# EAGLE design Adafruit PyPortal (EAGLE 9.3.0)

## Sheet 1 of 3
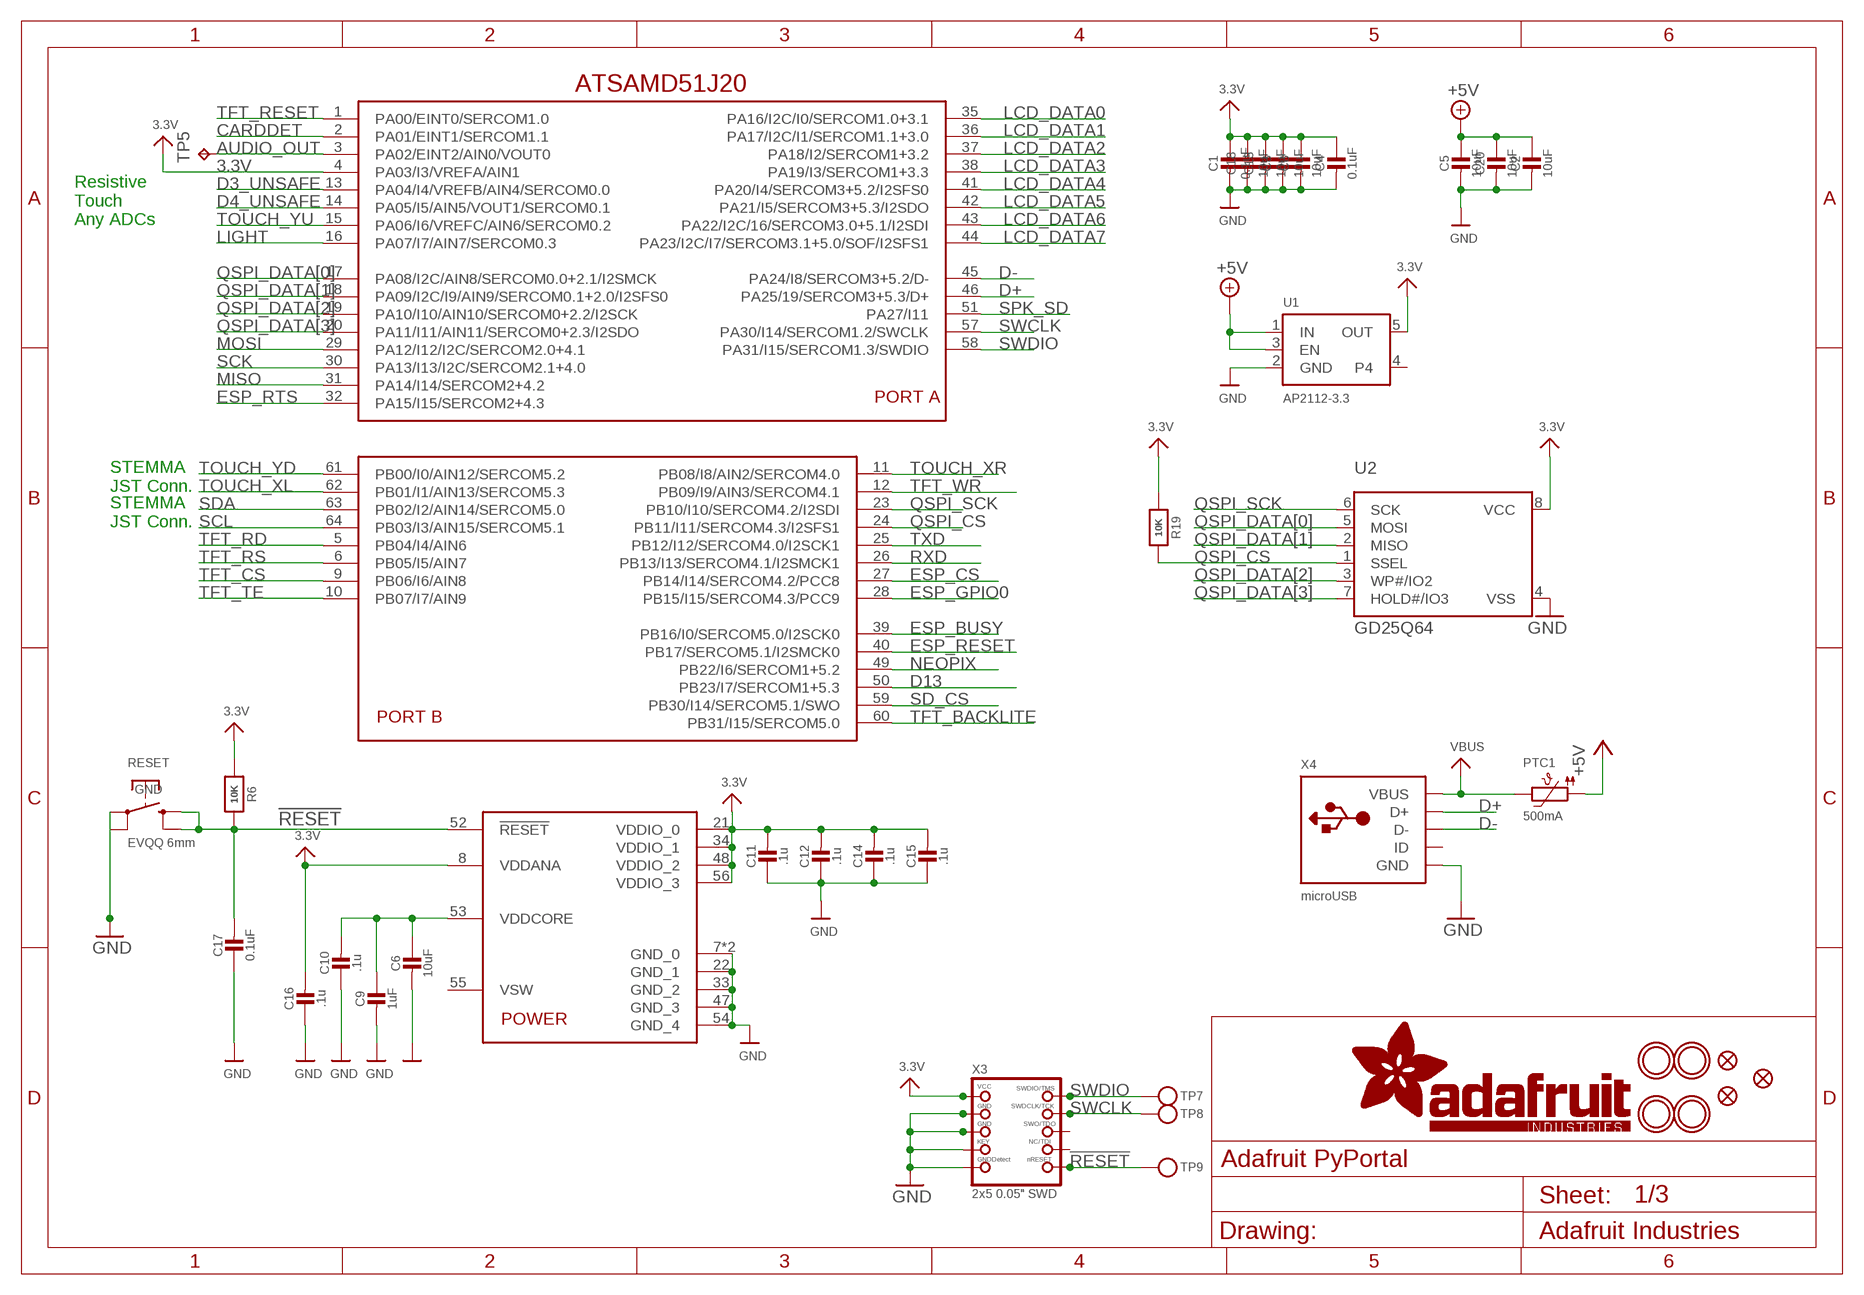
[diagram p0: schematic, sheet 1]

### Parts
C1  0.1uF  CAP_CERAMIC0603_NO  [0603-NO]
C2  10uF  CAP_CERAMIC0805-NOOUTLINE  [0805-NO]
C3  10uF  CAP_CERAMIC0805-NOOUTLINE  [0805-NO]
C4  0.1uF  CAP_CERAMIC0805-NOOUTLINE  [0805-NO]
C5  10uF  CAP_CERAMIC0805-NOOUTLINE  [0805-NO]
C6  10uF  CAP_CERAMIC0805-NOOUTLINE  [0805-NO]
C8  10uF  CAP_CERAMIC0805-NOOUTLINE  [0805-NO]
C9  1uF  CAP_CERAMIC0603_NO  [0603-NO]
C10  .1u  CAP_CERAMIC0603_NO  [0603-NO]
C11  .1u  CAP_CERAMIC0603_NO  [0603-NO]
C12  .1u  CAP_CERAMIC0603_NO  [0603-NO]
C13  10uF  CAP_CERAMIC0805-NOOUTLINE  [0805-NO]
C14  .1u  CAP_CERAMIC0603_NO  [0603-NO]
C15  .1u  CAP_CERAMIC0603_NO  [0603-NO]
C16  .1u  CAP_CERAMIC0603_NO  [0603-NO]
C17  0.1uF  CAP_CERAMIC0603_NO  [0603-NO]
C18  10uF  CAP_CERAMIC0805-NOOUTLINE  [0805-NO]
C20  10uF  CAP_CERAMIC0805-NOOUTLINE  [0805-NO]
PTC1  500mA  PTC1206  [1206]
R6  10K  RESISTOR_0603_NOOUT  [0603-NO]
R19  10K  RESISTOR_0603_NOOUT  [0603-NO]
RESET  EVQQ 6mm  SWITCH_TACT_SMT_EVQQ2_SMALL  [EVQ-Q2_SMALLER]
TP5  TPTP15R  [TP15R]
TP7  TESTPOINTROUND1.5MM  [TESTPOINT_ROUND_1.5MM]
TP8  TESTPOINTROUND1.5MM  [TESTPOINT_ROUND_1.5MM]
TP9  TESTPOINTROUND1.5MM  [TESTPOINT_ROUND_1.5MM]
U1  AP2112-3.3  VREG_SOT23-5  [SOT23-5]
U2  GD25Q64  SPIFLASH_8PIN208MIL  [SOIC8_208MIL]
U$2  ATSAMD51J20  ATSAMD51J  [PQFN64-1]
U$7  MOUNTINGHOLE3.0THIN  [MOUNTINGHOLE_3.0_PLATEDTHIN]
U$9  FIDUCIAL_1MM  [FIDUCIAL_1MM]
U$11  FIDUCIAL_1MM  [FIDUCIAL_1MM]
U$15  MOUNTINGHOLE3.0THIN  [MOUNTINGHOLE_3.0_PLATEDTHIN]
U$16  MOUNTINGHOLE3.0THIN  [MOUNTINGHOLE_3.0_PLATEDTHIN]
U$17  MOUNTINGHOLE3.0THIN  [MOUNTINGHOLE_3.0_PLATEDTHIN]
U$23  FIDUCIAL_1MM  [FIDUCIAL_1MM]
X3  2x5 0.05" SWD  JTAG-CORTEXBOXPOSTS  [2X05_1.27MM_BOX_POSTS]
X4  microUSB  USB_MICRO_20329_V2  [4UCONN_20329_V2]

### Nets
3.3V [power]: C1.1 C3.1 C4.1 C8.1 C11.2 C12.2 C13.1 C14.2 C15.2 C16.2 C18.1 R6.1 R19.1 U1.5(OUT) U2.8(VCC) U$2.4(PA03/I3/VREFA/AIN1) U$2.8(VDDANA) U$2.21(VDDIO_0) U$2.34(VDDIO_1) U$2.48(VDDIO_2) U$2.56(VDDIO_3) X3.1(VCC) ; also sheet 2,3
!RESET: C17.2 R6.2 RESET.B'(S1) RESET.B(S) TP9.P$1 U$2.52(!RESET) X3.10(NRESET)
+5V [power]: C2.1 C5.1 C20.1 PTC1.1 U1.1(IN) U1.3(EN) ; also sheet 2,3
AUDIO_OUT: TP5.TP U$2.3(PA02/EINT2/AIN0/VOUT0) ; also sheet 3
CARDDET: U$2.2(PA01/EINT1/SERCOM1.1) ; also sheet 2
D3_UNSAFE: U$2.13(PA04/I4/VREFB/AIN4/SERCOM0.0) ; also sheet 3
D4_UNSAFE: U$2.14(PA05/I5/AIN5/VOUT1/SERCOM0.1) ; also sheet 3
D13: U$2.50(PB23/I7/SERCOM1+5.3) ; also sheet 3
D+: U$2.46(PA25/19/SERCOM3+5.3/D+) X4.D+
D-: U$2.45(PA24/I8/SERCOM3+5.2/D-) X4.D-
ESP_BUSY: U$2.39(PB16/I0/SERCOM5.0/I2SCK0) ; also sheet 2
ESP_CS: U$2.27(PB14/I14/SERCOM4.2/PCC8) ; also sheet 2
ESP_GPIO0: U$2.28(PB15/I15/SERCOM4.3/PCC9) ; also sheet 2
ESP_RESET: U$2.40(PB17/SERCOM5.1/I2SMCK0) ; also sheet 2
ESP_RTS: U$2.32(PA15/I15/SERCOM2+4.3) ; also sheet 2
GND: C1.2 C2.2 C3.2 C4.2 C5.2 C6.2 C8.2 C9.2 C10.1 C11.1 C12.1 C13.2 C14.1 C15.1 C16.1 C17.1 C18.2 C20.2 RESET.A'(P1) RESET.A(P) U1.2(GND) U2.4(VSS) U$2.7(GND_0) U$2.22(GND_1) U$2.33(GND_2) U$2.47(GND_3) U$2.54(GND_4) U$2.EXP(GND_0) X3.3(GND) X3.5(GND) X3.7(KEY) X3.9(GNDDETECT) X4.BASE@1(GND) X4.BASE@2(GND) X4.GND X4.SPRT@1(GND) X4.SPRT@2(GND) X4.SPRT@3(GND) X4.SPRT@4(GND) ; also sheet 2,3
LCD_DATA0: U$2.35(PA16/I2C/I0/SERCOM1.0+3.1) ; also sheet 2
LCD_DATA1: U$2.36(PA17/I2C/I1/SERCOM1.1+3.0) ; also sheet 2
LCD_DATA2: U$2.37(PA18/I2/SERCOM1+3.2) ; also sheet 2
LCD_DATA3: U$2.38(PA19/I3/SERCOM1+3.3) ; also sheet 2
LCD_DATA4: U$2.41(PA20/I4/SERCOM3+5.2/I2SFS0) ; also sheet 2
LCD_DATA5: U$2.42(PA21/I5/SERCOM3+5.3/I2SDO) ; also sheet 2
LCD_DATA6: U$2.43(PA22/I2C/16/SERCOM3.0+5.1/I2SDI) ; also sheet 2
LCD_DATA7: U$2.44(PA23/I2C/I7/SERCOM3.1+5.0/SOF/I2SFS1) ; also sheet 2
LIGHT: U$2.16(PA07/I7/AIN7/SERCOM0.3) ; also sheet 3
MISO: U$2.31(PA14/I14/SERCOM2+4.2) ; also sheet 2
MOSI: U$2.29(PA12/I12/I2C/SERCOM2.0+4.1) ; also sheet 2
NEOPIX: U$2.49(PB22/I6/SERCOM1+5.2) ; also sheet 3
QSPI_CS: R19.2 U2.1(SSEL) U$2.24(PB11/I11/SERCOM4.3/I2SFS1)
QSPI_DATA[0]: U2.5(MOSI) U$2.17(PA08/I2C/AIN8/SERCOM0.0+2.1/I2SMCK)
QSPI_DATA[1]: U2.2(MISO) U$2.18(PA09/I2C/I9/AIN9/SERCOM0.1+2.0/I2SFS0)
QSPI_DATA[2]: U2.3(WP#/IO2) U$2.19(PA10/I10/AIN10/SERCOM0+2.2/I2SCK)
QSPI_DATA[3]: U2.7(HOLD#/IO3) U$2.20(PA11/I11/AIN11/SERCOM0+2.3/I2SDO)
QSPI_SCK: U2.6(SCK) U$2.23(PB10/I10/SERCOM4.2/I2SDI)
RXD: U$2.26(PB13/I13/SERCOM4.1/I2SMCK1) ; also sheet 2
SCK: U$2.30(PA13/I13/I2C/SERCOM2.1+4.0) ; also sheet 2
SCL: U$2.64(PB03/I3/AIN15/SERCOM5.1) ; also sheet 3
SD_CS: U$2.59(PB30/I14/SERCOM5.1/SWO) ; also sheet 2
SDA: U$2.63(PB02/I2/AIN14/SERCOM5.0) ; also sheet 3
SPK_SD: U$2.51(PA27/I11) ; also sheet 3
SWCLK: TP8.P$1 U$2.57(PA30/I14/SERCOM1.2/SWCLK) X3.4(SWDCLK)
SWDIO: TP7.P$1 U$2.58(PA31/I15/SERCOM1.3/SWDIO) X3.2(SWDIO)
TFT_BACKLITE: U$2.60(PB31/I15/SERCOM5.0) ; also sheet 2
TFT_CS: U$2.9(PB06/I6/AIN8) ; also sheet 2
TFT_RD: U$2.5(PB04/I4/AIN6) ; also sheet 2
TFT_RESET: U$2.1(PA00/EINT0/SERCOM1.0) ; also sheet 2
TFT_RS: U$2.6(PB05/I5/AIN7) ; also sheet 2
TFT_TE: U$2.10(PB07/I7/AIN9) ; also sheet 2
TFT_WR: U$2.12(PB09/I9/AIN3/SERCOM4.1) ; also sheet 2
TOUCH_XL: U$2.62(PB01/I1/AIN13/SERCOM5.3) ; also sheet 2
TOUCH_XR: U$2.11(PB08/I8/AIN2/SERCOM4.0) ; also sheet 2
TOUCH_YD: U$2.61(PB00/I0/AIN12/SERCOM5.2) ; also sheet 2
TOUCH_YU: U$2.15(PA06/I6/VREFC/AIN6/SERCOM0.2) ; also sheet 2
TXD: U$2.25(PB12/I12/SERCOM4.0/I2SCK1) ; also sheet 2
VBUS [power]: PTC1.2 X4.VBUS
VDDCORE: C6.1 C9.1 C10.2 U$2.53(VDDCORE)
Unconnected: U1.4 U$2.55(VSW) X3.6(SWO) X3.8(TDI) X4.ID

### Notes on the sheet
- ATSAMD51J20
- Resistive
  Touch
  Any ADCs
- STEMMA
  JST Conn.
- STEMMA
  JST Conn.

## Sheet 2 of 3
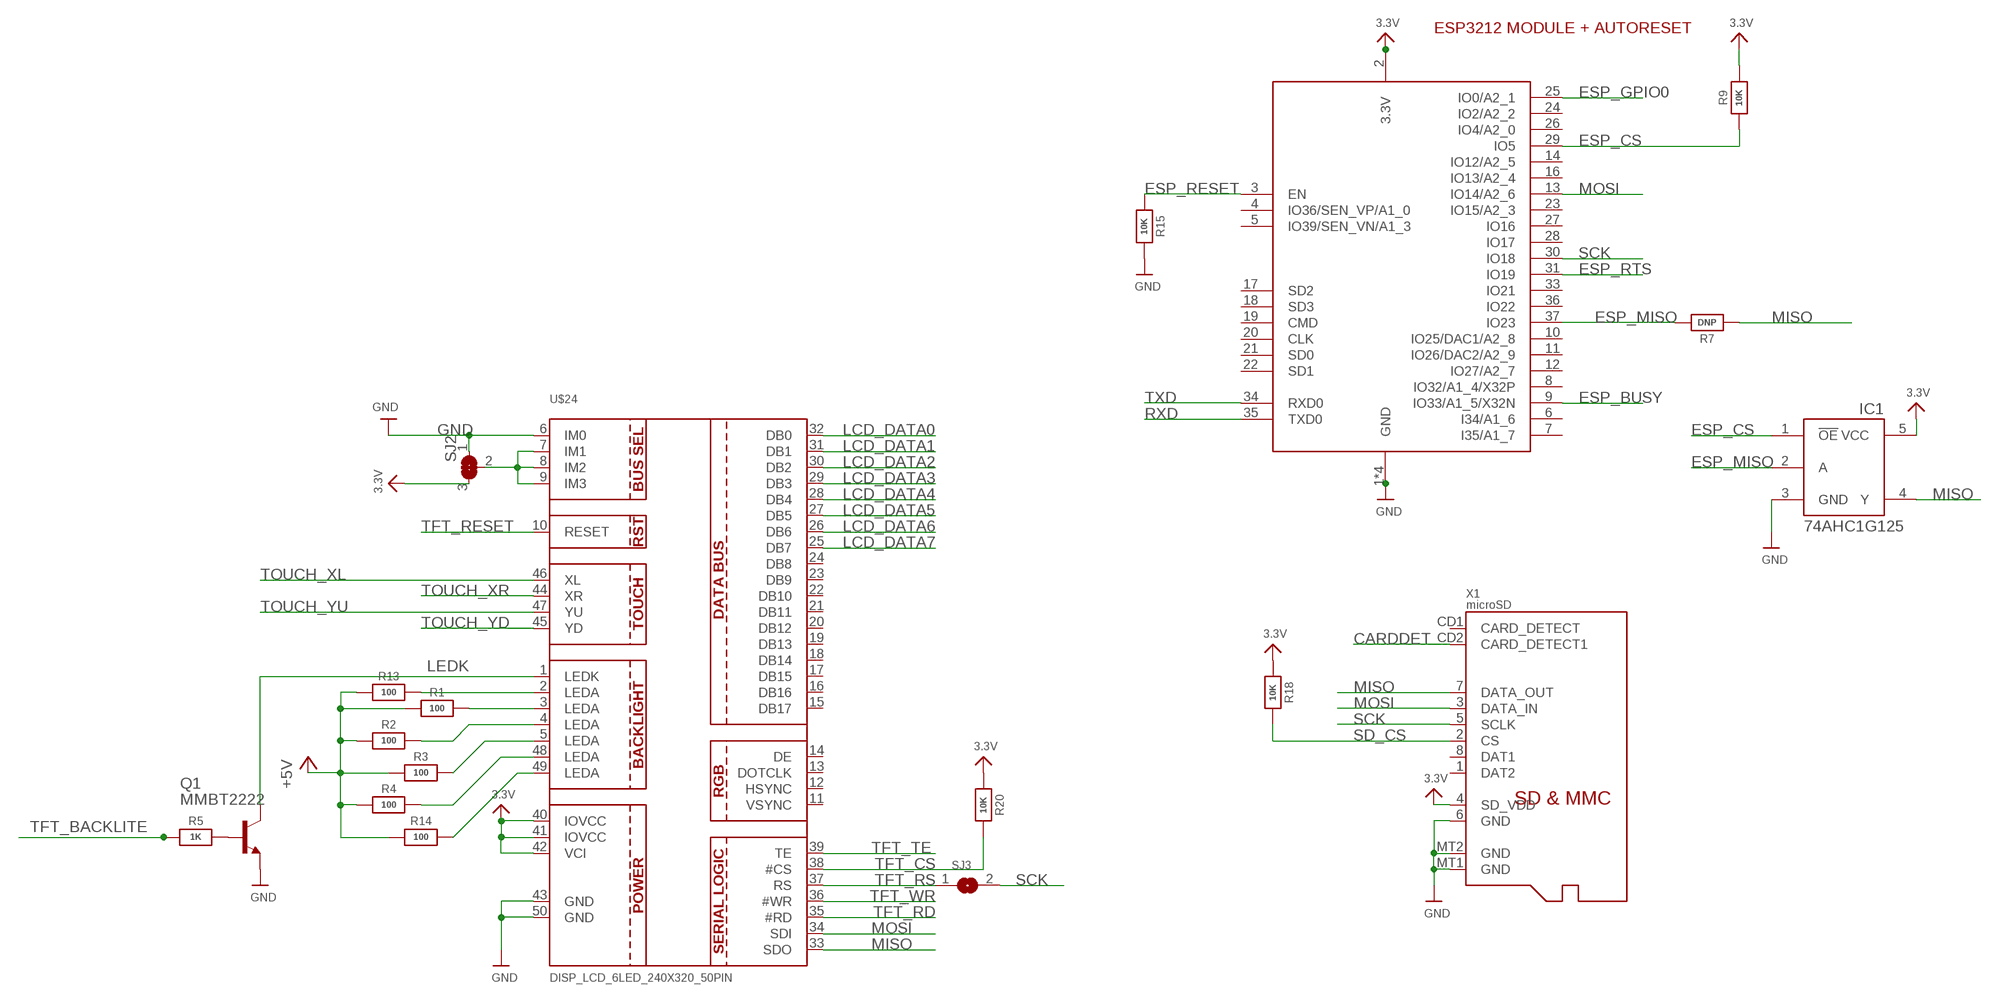
[diagram p1: schematic, sheet 2]

### Parts
IC1  74AHC1G125  [SOT23-5L]
Q1  MMBT2222  MMBT2222ALT1-NPN-SOT23-BEC  [SOT23-BEC]
R1  100  RESISTOR_0603_NOOUT  [0603-NO]
R2  100  RESISTOR_0603_NOOUT  [0603-NO]
R3  100  RESISTOR_0603_NOOUT  [0603-NO]
R4  100  RESISTOR_0603_NOOUT  [0603-NO]
R5  1K  RESISTOR_0603_NOOUT  [0603-NO]
R7  DNP  RESISTOR_0603_NOOUT  [0603-NO]
R9  10K  RESISTOR_0603_NOOUT  [0603-NO]
R13  100  RESISTOR_0603_NOOUT  [0603-NO]
R14  100  RESISTOR_0603_NOOUT  [0603-NO]
R15  10K  RESISTOR_0603_NOOUT  [0603-NO]
R18  10K  RESISTOR_0603_NOOUT  [0603-NO]
R20  10K  RESISTOR_0603_NOOUT  [0603-NO]
SJ2  SOLDERJUMPER_2WAY  [SOLDERJUMPER_2WAY_OPEN_NOPASTE]
SJ3  SOLDERJUMPER  [SOLDERJUMPER_ARROW_NOPASTE]
U$24  DISP_LCD_6LED_240X320_50PIN  [TFT_3.2IN_240X320_50PIN]
X1  microSD  MICROSD  [MICROSD]
X6  ESP32_WROOM32  [WROOM32]

### Nets
3.3V [power]: IC1.5(VCC) R9.2 R18.1 R20.1 SJ2.3 U$24.40(IOVCC) U$24.41(IOVCC) U$24.42(VCI) X1.4(SD_VDD) X6.2(3.3V) ; also sheet 1,3
+5V [power]: R1.1 R2.1 R3.1 R4.1 R13.1 R14.1 ; also sheet 1,3
CARDDET: X1.CD2(CARD_DETECT1) ; also sheet 1
ESP_BUSY: X6.9(IO33/A1_5/X32N) ; also sheet 1
ESP_CS: IC1.1(!OE) R9.1 X6.29(IO5) ; also sheet 1
ESP_GPIO0: X6.25(IO0/A2_1) ; also sheet 1
ESP_MISO: IC1.2(A) R7.2 X6.37(IO23)
ESP_RESET: R15.1 X6.3(EN) ; also sheet 1
ESP_RTS: X6.31(IO19) ; also sheet 1
GND: IC1.3(GND) Q1.E R15.2 SJ2.1 U$24.6(IM0) U$24.43(GND) U$24.50(GND) X1.6(GND) X1.MT1(GND) X1.MT2(GND) X6.1(GND) X6.15(GND) X6.38(GND) X6.P$1(GND) ; also sheet 1,3
LCD_DATA0: U$24.32(DB0) ; also sheet 1
LCD_DATA1: U$24.31(DB1) ; also sheet 1
LCD_DATA2: U$24.30(DB2) ; also sheet 1
LCD_DATA3: U$24.29(DB3) ; also sheet 1
LCD_DATA4: U$24.28(DB4) ; also sheet 1
LCD_DATA5: U$24.27(DB5) ; also sheet 1
LCD_DATA6: U$24.26(DB6) ; also sheet 1
LCD_DATA7: U$24.25(DB7) ; also sheet 1
LEDK: Q1.C U$24.1(LEDK)
MISO: IC1.4(Y) R7.1 U$24.33(SDO) X1.7(DATA_OUT) ; also sheet 1
MOSI: U$24.34(SDI) X1.3(DATA_IN) X6.13(IO14/A2_6) ; also sheet 1
N$1: R4.2 U$24.48(LEDA)
N$2: R1.2 U$24.3(LEDA)
N$3: R2.2 U$24.4(LEDA)
N$4: R3.2 U$24.5(LEDA)
N$5: SJ2.2 U$24.7(IM1) U$24.8(IM2) U$24.9(IM3)
N$6: R14.2 U$24.49(LEDA)
N$7: R13.2 U$24.2(LEDA)
N$16: Q1.B R5.2
RXD: X6.35(TXD0) ; also sheet 1
SCK: SJ3.2 X1.5(SCLK) X6.30(IO18) ; also sheet 1
SD_CS: R18.2 X1.2(CS) ; also sheet 1
TFT_BACKLITE: R5.1 ; also sheet 1
TFT_CS: R20.2 U$24.38(#CS) ; also sheet 1
TFT_RD: U$24.35(#RD) ; also sheet 1
TFT_RESET: U$24.10(RESET) ; also sheet 1
TFT_RS: SJ3.1 U$24.37(RS) ; also sheet 1
TFT_TE: U$24.39(TE) ; also sheet 1
TFT_WR: U$24.36(#WR) ; also sheet 1
TOUCH_XL: U$24.46(XL) ; also sheet 1
TOUCH_XR: U$24.44(XR) ; also sheet 1
TOUCH_YD: U$24.45(YD) ; also sheet 1
TOUCH_YU: U$24.47(YU) ; also sheet 1
TXD: X6.34(RXD0) ; also sheet 1
Unconnected: U$24.11(VSYNC) U$24.12(HSYNC) U$24.13(DOTCLK) U$24.14(DE) U$24.15(DB17) U$24.16(DB16) U$24.17(DB15) U$24.18(DB14) U$24.19(DB13) U$24.20(DB12) U$24.21(DB11) U$24.22(DB10) U$24.23(DB9) U$24.24(DB8) X1.1(DAT2) X1.8(DAT1) X1.CD1(CARD_DETECT) X6.4(IO36/SEN_VP/A1_0) X6.5(IO39/SEN_VN/A1_3) X6.6(I34/A1_6) X6.7(I35/A1_7) X6.8(IO32/A1_4/X32P) X6.10(IO25/DAC1/A2_8) X6.11(IO26/DAC2/A2_9) X6.12(IO27/A2_7) X6.14(IO12/A2_5) X6.16(IO13/A2_4) X6.17(SD2) X6.18(SD3) X6.19(CMD) X6.20(CLK) X6.21(SD0) X6.22(SD1) X6.23(IO15/A2_3) X6.24(IO2/A2_2) X6.26(IO4/A2_0) X6.27(IO16) X6.28(IO17) X6.33(IO21) X6.36(IO22)

### Notes on the sheet
- ESP3212 MODULE + AUTORESET

## Sheet 3 of 3
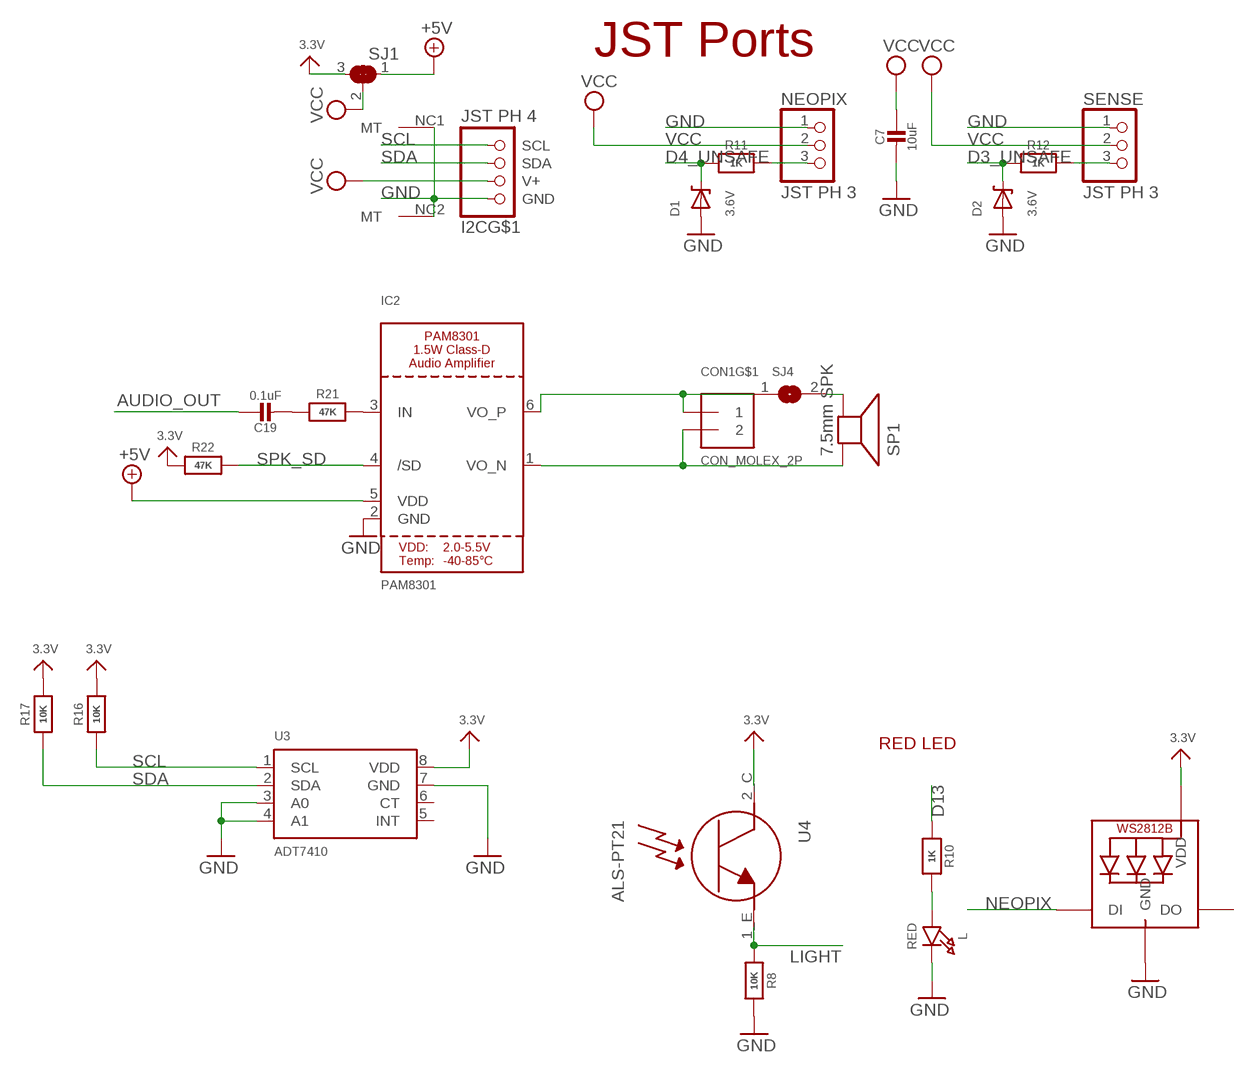
[diagram p2: schematic, sheet 3]

### Parts
C7  10uF  CAP_CERAMIC0805-NOOUTLINE  [0805-NO]
C19  0.1uF  CAP_CERAMIC0603_NO  [0603-NO]
CON1  CON_MOLEX_2P  [53398-0271]
D1  3.6V  DIODE-ZENERSOD323  [SOD-323]
D2  3.6V  DIODE-ZENERSOD323  [SOD-323]
I2C  JST PH 4  STEMMA_I2C_RASMT  [JSTPH4]
IC2  PAM8301  [SOT23-6]
L  RED  LED0805_NOOUTLINE  [CHIPLED_0805_NOOUTLINE]
LED1  WS2812B3535  [LED3535]
NEOPIX  JST PH 3  CON_JST_PH_3PIN  [JSTPH3]
R8  10K  RESISTOR_0603_NOOUT  [0603-NO]
R10  1K  RESISTOR_0603_NOOUT  [0603-NO]
R11  1K  RESISTOR_0603_NOOUT  [0603-NO]
R12  1K  RESISTOR_0603_NOOUT  [0603-NO]
R16  10K  RESISTOR_0603_NOOUT  [0603-NO]
R17  10K  RESISTOR_0603_NOOUT  [0603-NO]
R21  47K  RESISTOR_0603_NOOUT  [0603-NO]
R22  47K  RESISTOR_0603_NOOUT  [0603-NO]
SENSE  JST PH 3  CON_JST_PH_3PIN  [JSTPH3]
SJ1  SOLDERJUMPER_2WAY  [SOLDERJUMPER_2WAY_OPEN_NOPASTE]
SJ4  SOLDERJUMPERCLOSED  [SOLDERJUMPER_CLOSEDWIRE]
SP1  7.5mm SPK  SPEAKER_7.5MM  [BUZZER_SMT_7.5MM]
U3  ADT7410  TEMP_ADT7410  [SOIC8_150MIL]
U4  ALS-PT21  PHOTOTRANSISTOR_PT26-21C  [ALS-PT26-21C]

### Nets
3.3V [power]: LED1.2(VDD) R16.1 R17.1 R22.1 SJ1.3 U3.8(VDD) U4.2_C(C) ; also sheet 1,2
+5V [power]: IC2.5(VDD) SJ1.1 ; also sheet 1,2
AUDIO_OUT: C19.1 ; also sheet 1
D3: R12.1 SENSE.3
D3_UNSAFE: D2.C R12.2 ; also sheet 1
D4: NEOPIX.3 R11.1
D4_UNSAFE: D1.C R11.2 ; also sheet 1
D13: R10.1 ; also sheet 1
GND: C7.2 D1.A D2.A I2C.1(GND) I2C.NC1(MT) I2C.NC2(MT) IC2.2(GND) L.C LED1.4(GND) NEOPIX.1 R8.1 SENSE.1 U3.3(A0) U3.4(A1) U3.7(GND) ; also sheet 1,2
LIGHT: R8.2 U4.1_E(E) ; also sheet 1
N$8: L.A R10.2
N$10: C19.2 R21.1
N$11: IC2.3(IN) R21.2
N$13: SJ4.2 SP1.-
NEOPIX: LED1.1(DI) ; also sheet 1
SCL: I2C.4(SCL) R16.2 U3.1(SCL) ; also sheet 1
SDA: I2C.3(SDA) R17.2 U3.2(SDA) ; also sheet 1
SPK_SD: IC2.4(/SD) R22.2 ; also sheet 1
SPKR+: CON1.2 IC2.1(VO_N) SP1.+
SPRK-: CON1.1 IC2.6(VO_P) SJ4.1
VCC: C7.1 I2C.2(V+) NEOPIX.2 SENSE.2 SJ1.2
Unconnected: CON1.M1(MT) CON1.M2(MT) LED1.3(DO) U3.5(INT) U3.6(CT)

### Notes on the sheet
- JST Ports
- RED LED

## Library data of the parts
C1-C20 = microbuilder:CAP_CERAMIC: Ceramic Capacitors For new designs, use the packages preceded by an '_' character since they are more reliable: The following footprints should be used on most boards: _0402 - Standard footprint for regular board layouts _0603 - Standard footprint for regular board layouts _0805 - Standard footprint for regular board layouts _1206 - Standard footprint for regular board layouts For extremely tight-pitch boards where space is at a premium, the following 'micro-pitch' footprints can be used (smaller pads, no silkscreen outline, etc.): _0402MP - Micro-pitch footprint for very dense/compact boards _0603MP - Micro-pitch footprint for very dense/compact boards _0805MP - Micro-pitch footprint for very dense/compact boards _1206MP - Micro-pitch footprint for very dense/compact boards
CON1 = microbuilder:CON_MOLEX_2P
D1 D2 = microbuilder:DIODE-ZENER: Zener Diode SMA: 30V 1W Zener Diode, 1.2Vf - Digikey: SMAZ30-FDICT-ND
I2C = microbuilder:STEMMA_I2C
IC1 = adafruit:74AHC1G125
IC2 = microbuilder:PAM8301
L = microbuilder:LED: LED 0603 - 0603 Surface Mount Package 2mA: Green LED - Low Power (3.9mcd, 2ma, 1.7Vf) - Digikey: 475-2709-2-ND Orange LED - Low Power (9.8mcd, 2ma, 1.8Vf) - Digikey: 475-1194-2-ND Red LED - Low Power (5mcd, 2ma, 1.8Vf) - Digikey: 475-1195-2-ND Yellow LED - Low Power (7mcd, 2ma, 1.8Vf) - Digikey: 475-1196-2-ND 5mA: Blue LED - Low Power (17mcd, 5ma, 2.9Vf) - Digikey: LNJ937W8CRACT-ND 0805 - 0805 Surface Mount Package 2mA: Red LED (8.8mcd, 2mA, 1.8Vf, Clear) - Low Power [Digikey: 475-2510-1-ND] Green LED (5mcd, 2mA, 1.8Vf, Clear) - Low Power [Digikey: 475-2730-1-ND] Yellow LED (11.3mcd, 2mA, 1.8Vf, Clear) - Low Power [Digikey: 475-2555-1-ND] 20mA: Red LED (104mcd, 20mA, Diffused) - LS R976 [Digikey: 475-1278-6-ND] Red LED (12mcd, 20mA, 2.0Vf, Clear) - APT2012EC [Digikey: 754-1128-1-ND] Green LED (15mcd, 20mA, 2.2Vf, Clear) - APT2012GC [Digikey: 754-1131-1-ND] Orange LED (160mcd, 20mA, 2.1Vf, Clear) - APT2012SECK [Digikey: 754-1130-1-ND] 1206 - 1206 Surface Mount Package Green LED (26mcd, 20mA, Diffused) - LG N971 [Digikey: 475-1407-6-ND] Red LED (15mcd, 20mA, Diffused) - LH N974 [Digikey: 475-1416-6-ND] Cree - Cree High-Power Surface Mount LEDs XPEBWT-L1-0000-00D50 - White 111lm 350mA 2.9Vf 6200K 110° XTEAWT-00-0000-00000LEE3 - White 114lm 350mA 2.85Vf 5000K 115° Everlight - Everlight 45-21 Series Surface Mount LEDs 45-21/QK2C-B2832AC2CB2/2T - Warm White 2000mcd 20mA 3.25Vf 3050K 120° 45-21/LK2C-B38452C4CB2/2T - Nuetral White 2000mcd 20mA 3.25Vf 4150K 120° 45-21/LK2C-B50634C6CB2/2T - Cold White 2200mcd 20mA 3.25Vf 5650K 120° PLCC2 Reverse Mount LS T77K-J1L2-1-0-2-R18-Z - Red 11.25mcd 2mA 1.8Vf 630nm 120° LO T77K-L1M2-24-Z - Orange 19.6mcd 2mA 1.8Vf 606nm 120° LY T77K-K2M1-26-Z - Yellow 15.7mcd 2mA 1.8Vf 587nm 120°
LED1 = microbuilder:WS2812B
NEOPIX SENSE = microbuilder:CON_JST_PH_3PIN
PTC1 = microbuilder:PTC: PTC (Resettable Fuse) 1206 Package 250mA PTC (16V Max, Time-to-Trip: 0.08s) - Digikey: F2110CT-ND 1210 Package 100mA PTC (30V Max, Time-to-Trip: 0.6s) - Digikey: MF-USMF010-2CT-ND 1812 Package 750mA PTC (24V Max, Time-to-Trip: 0.2s) - Digikey: MF-MSMF075/24-2CT-ND
Q1 = transistor-neu-to92:*-NPN-: NPN Transistror
R1-R22 = microbuilder:RESISTOR: Resistors For new designs, use the packages preceded by an '_' character since they are more reliable: The following footprints should be used on most boards: _0402 - Standard footprint for regular board layouts _0603 - Standard footprint for regular board layouts _0805 - Standard footprint for regular board layouts _1206 - Standard footprint for regular board layouts For extremely tight-pitch boards where space is at a premium, the following 'micro-pitch' footprints can be used (smaller pads, no silkscreen outline, etc.): _0402MP - Micro-pitch footprint for very dense/compact boards _0603MP - Micro-pitch footprint for very dense/compact boards _0805MP - Micro-pitch footprint for very dense/compact boards _1206MP - Micro-pitch footprint for very dense/compact boards
RESET = microbuilder:SWITCH_TACT_SMT: SMT Tact Switches 6x6mm - Digikey: P12940SCT-ND KMR2 (4.6x2.8mm) - Digikey: 401-1426-1-ND EVQ-PQHB55 - Light Touch, 160GF (4.5x4.5mm) - Digikey: P8090SCT-ND KMT0 - KMT021 NGJ LHS (etc.) IP68/Waterproof - Digikey: CKN10289CT-ND
SJ1 SJ2 = microbuilder:SOLDERJUMPER_2WAY: 2-Way Solder Jumper
SJ3 = microbuilder:SOLDERJUMPER: SMD Solder JUMPER Solder the two pads together to create a connection, or remove the solder to break it. REFLOW - Use this footprint for solder paste and reflow ovens. WAVE - Use this footprint for hand-soldering (larger pads). CLOSED - Has a trace between the two pads to ensure it is closed by default. The trace needs to be cut to disable the jumper, and can be closed again by creating a solder bridge between the two pads.; BOM: EXCLUDE
SJ4 = microbuilder:SOLDERJUMPER: SMD Solder JUMPER Solder the two pads together to create a connection, or remove the solder to break it. REFLOW - Use this footprint for solder paste and reflow ovens. WAVE - Use this footprint for hand-soldering (larger pads). CLOSED - Has a trace between the two pads to ensure it is closed by default. The trace needs to be cut to disable the jumper, and can be closed again by creating a solder bridge between the two pads.
SP1 = microbuilder:SPEAKER: SPEAKER Source: Buerklin Added PS12 (for part # PS1240 piezo) http://www.ladyada.net/library/pcb/eaglelibrary.html
TP5 = testpad:TP: Test pad
TP7-TP9 = microbuilder:TESTPOINT: Test Point Various test points for characterisation and PCB testing TESTPOINT_SMT - Compact Surface Mount Test Point [Digikey: 5016KTR-ND]
U1 = microbuilder:VREG_SOT23-5: SOT23-5 Fixed Voltage Regulators Part Current Out V Out V In V Dropout θJA (°C/W) TJ (°C) Digikey Part No. ADP121 150mA 3.3V 3.4-5.5V 0.09V @ 150mA -- -- ADP121-AUJZ33R7CT-ND ADP121 150mA 3.0V 3.1-5.5V 0.09V @ 150mA -- -- ADP121-AUJZ30R7CT-ND ADP122 300mA 3.3V 3.4-5.5V 0.085V @ 300mA -- -- ADP122AUJZ-3.3-R7CT-ND ADP1712 300mA 3.3V 3.5-5.5V 0.17V @ 300mA -- -- ADP1712AUJZ-3.3-R7TR-ND AP7311 (Low Cost) 150mA 3.3V 3.5-6V 0.15V @ 150mA -- -- AP7311-33WG-7DICT-ND LD39015M18R 150mA 1.8V 1.9V-5.5V 0.08V @ 100mA -- -- 497-6977-1-ND LP2985A-33DBVR 150mA 3.3V 3.3-16V 0.28V @ 150mA 206 150 296-18479-1-ND MCP1824T-3302E/OT 300mA 3.3V 3.5V-6V 0.2V @ 300mA -- -- MCP1824T-3302E/OTCT-ND MIC5205-2.5YM5 TR 150mA 2.5V 2.7-16V 0.165V @ 150mA -- -- 576-1257-2-ND MIC5205-3.0YM5 TR 150mA 3.0V 3.2V-16V 0.165V @ 150mA -- -- 576-1258-2-ND MIC5205-3.3YM5 TR 150mA 3.3V 3.5V-16V 0.165V @ 150mA -- -- 576-1259-2-ND TPS780330220 150mA 3.3V+2.2V 3.6-5.5V 250mV Max -- -- 296-23332-1-ND TDA3663/N1,135 100mA 3.3V 3.5-45V 0.18V @ 50mA -- -- 568-5343-1-ND Max operating temp can be calculated using θJA, TJ (max junction temperature), and power in watts. Set the "Maximum Ambient Temperature" until it reaches TJ ("Max Junction Temperature"), which is the absolute limit for safe use of the regulator: Heat Sink Temperature Calculator <http://www.daycounter.com/Calculators/Heat-Sink-Temperature-Calculator.phtml> For example, With 12V source into a 3.3V LP2985 and a 30mA load, we are dissipating (12V-3.3V) * 0.03A = 0.261W. With a θJA of 206 °C/W, a TJ of 150°C, and 261mW we can safely use the chip without a heat sink up to 75°C (=147.1°C Junction Temperature).
U2 = microbuilder:SPIFLASH_8PIN: SOIC8 SPI Flash Be careful with the size since SOIC8 flash comes in several 'widths' SOIC8 150 mil M25P16 - 16Mbit (2Mbit x 8) Serial Flash (75MHz SPI Bus), Supply: 2.7-3.6V Digikey: SOIC8 - M25P16-VMN6P-ND SOIC8 208 mil W25Q16BVSSIG - 16Mbit (2Mbit x 8) Serial Flash (104MHz SPI Bus), Supply: 2.7-3.6V Digikey: SOIC8 - W25Q16BVSSIG-ND
U3 = microbuilder:TEMP_ADT7410: ADT7410 - 13-bit 0.5°C I2C Temperature Sensor Operating Voltage: 2.7-5.5V Temperature Range: -55°C-150°C Accuracy: 0.5°C from -40°C-105°C Shutdown Current: 2uA (3.3V) Typical Operating Current (1 Sample/s): 46uA (3.3V) Digikey: ADT7410TRZ-ND
U4 = microbuilder:PHOTOTRANSISTOR: ALS-PT19-315C - Analog Light Sensor VCC: 2.5-5.5V
U$2 = microbuilder:ATSAMD51J: ATSAMD51J cortex m4 microcontroller
U$7 U$15-U$17 = microbuilder:MOUNTINGHOLE: Mounting Hole For #2 screws (0.086"/2.18mm width, 0.094"/2.4mm hole) use 2.5mm; BOM: EXCLUDE
U$9 U$11 U$23 = microbuilder:FIDUCIAL: Fiducial Alignment Points Various fiducial points for machine vision alignment.; BOM: EXCLUDE
U$24 = microbuilder:DISP_LCD_6LED_240X320_50PIN
X1 = microbuilder:MICROSD: MicroSD/Transflash Card Holder with SPI pinout 3M: 2908-05WB-MG 4UConnector: 19656 Footprint courtesy: Adafruit Industries
X3 = microbuilder:JTAG-CORTEX: Serial Wire (SW-DP) Connector Standard 0.05" 10-pin connector is for use with the Cortex M and Cortex A SWD (serial wire debugger) interface (SW-DP) Connectors 2x05_1.27MM_SMT - Inexpensive surface-mount header with bare pins, compatible with standard 10-pin SWD cables (4UCON: 16846) 2x05_1.27MM_BOX_NOPOSTS - Polarised surface-mount box (4UCON with caps: 19735, without caps: 15117 2x05_1.27MM_BOX_POSTS - Polarised surface-mount box with mounting holes (4UCON: 20317) Pinout: http://infocenter.arm.com/help/topic/com.arm.doc.faqs/attached/13634/cortex_debug_connectors.pdf http://www.keil.com/peripherals/coresight/connectors.asp
X4 = microbuilder:USB: USB Connectors USBMINIB - Surface Mount Female Mini-B USB Connector 4UConnector: 06564
X6 = microbuilder:ESP32_WROOM32

## Net classes
1 power: width 0.305 mm

## Board
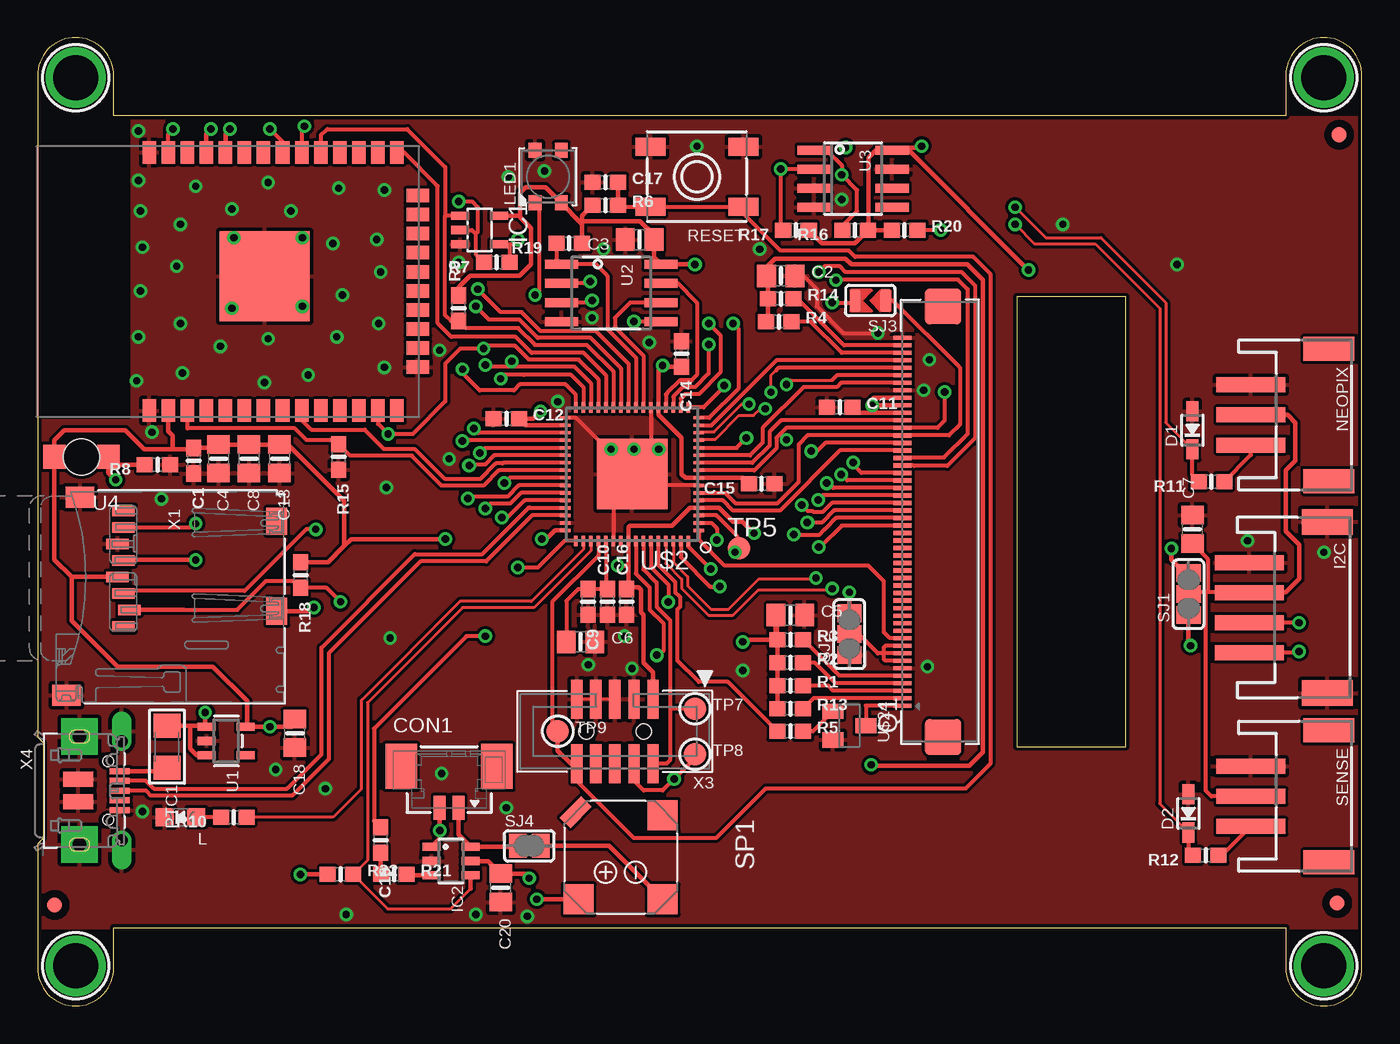
[diagram p3: board, top side]
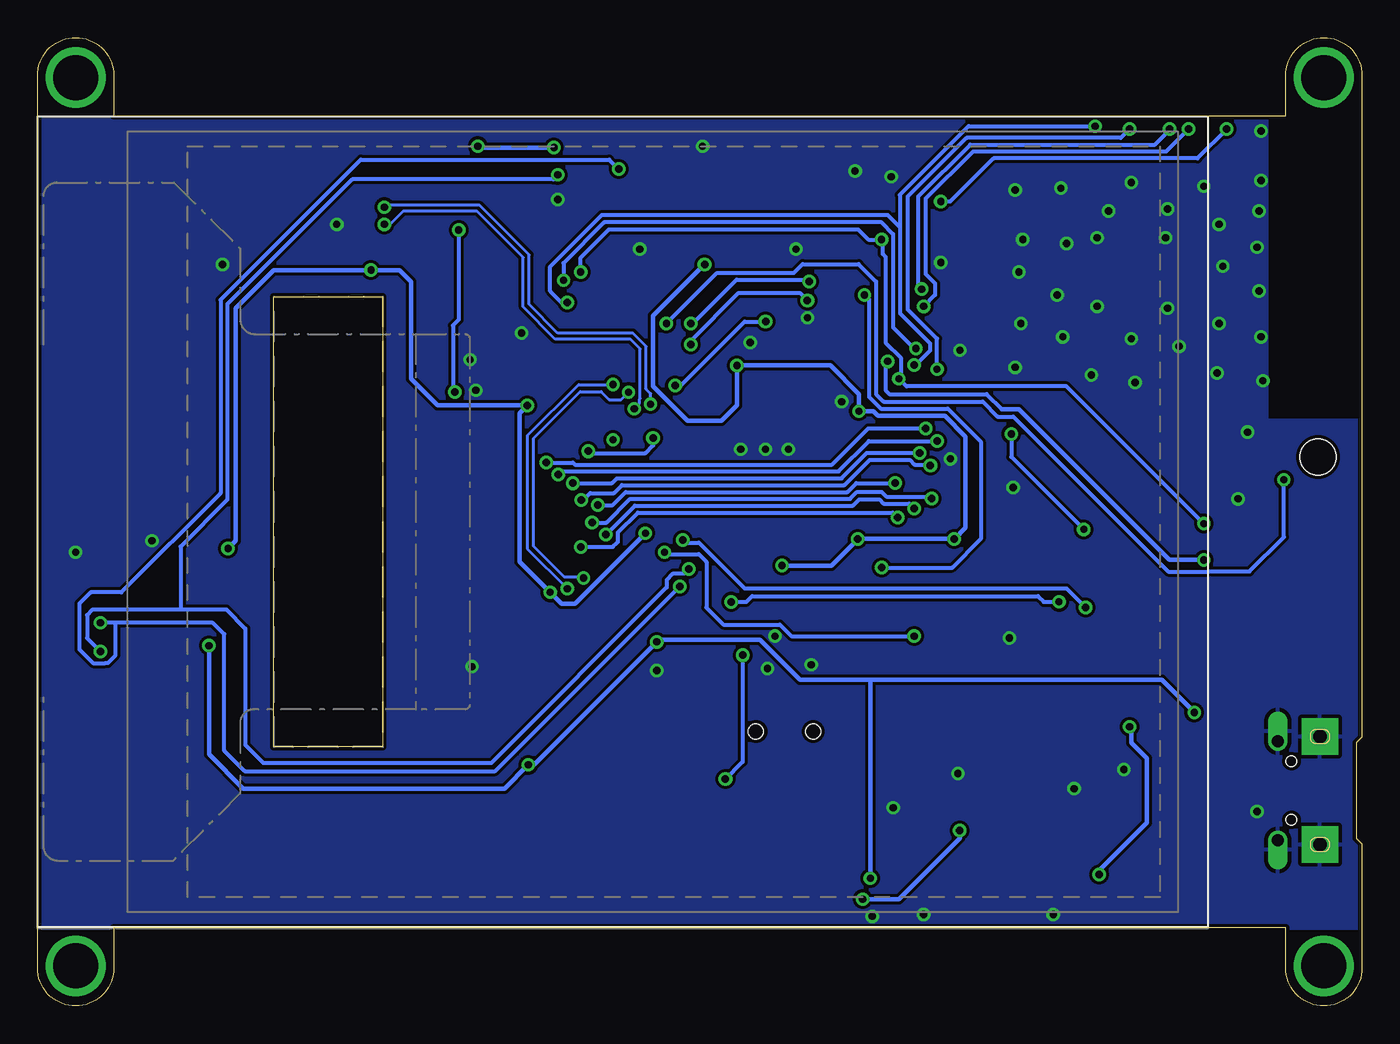
[diagram p4: board, bottom side, seen from below]

Size 88.27 x 64.52 mm. Coordinates in mm from the lower left corner, seen from the top.
Outline: 85.72,0 arc90 88.27,2.54 88.27,61.98 arc90 85.72,64.52 arc90 83.19,61.98 83.19,59.31 5.08,59.31 5.08,61.98 arc90 2.54,64.52 arc90 0,61.98 0,17.91 0.38,17.53 0.38,11.18 0,10.79 0,2.54 arc90 2.54,0 arc90 5.08,2.54 5.08,5.21 83.19,5.21 83.19,2.54 arc90 85.72,0
Outline: 65.28,17.27 72.52,17.27 72.52,47.24 65.28,47.24 65.28,17.27
Copper layers (1*16): Top 0.035mm / dielectric 1.5mm / Bottom 0.035mm
Design rules "adafruit *": minimum track width 8mil, minimum drill 19mil, track to track 8mil, track to pad 8mil, pad to pad 8mil, via to via 8mil, smd to smd 8mil, copper to edge 10mil, drill to drill 8mil, minimum pad ring 10mil, minimum via ring 8mil, stop-mask expansion 4mil, vias tented up to drill 20mil, thermal gap 10mil

### Footprints (pad centres in the part's own frame; a part is rotated, then mirrored left to right if it is on the bottom)
0603-NO = smd 1.075 x 1: 1 -0.85,0; 2 0.85,0
0805-NO = smd 1.24 x 1.5: 1 -0.95,0; 2 0.95,0
53398-0271 = smd 0.8 x 1.6: 1 0.625,-1.27; 2 -0.625,-1.27 | smd 2.1 x 3: M1 3.185,1.48; M2 -3.185,1.48
SOD-323 = smd 1.35 x 0.8: A 1.27,0; C -1.27,0
JSTPH4 = smd 1 x 4.6: 1 -3,-3.7; 2 -1,-3.7; 3 1,-3.7; 4 3,-3.7 | smd 1.7 x 3.4: NC1 -5.7,1.5; NC2 5.7,1.5
SOT23-5L = smd 0.55 x 1.2: 1 -0.95,-1.3; 2 0,-1.3; 3 0.95,-1.3; 4 0.95,1.3; 5 -0.95,1.3
SOT23-6 = smd 0.55 x 1.2: 1 -0.95,-1.3; 2 0,-1.3; 3 0.95,-1.3; 4 0.95,1.3; 5 0,1.3; 6 -0.95,1.3
CHIPLED_0805_NOOUTLINE = smd 1.2 x 1.2: A 0,-1.05; C 0,1.05
LED3535 = smd 1 x 0.85: 1 -1.75,0.875; 2 -1.75,-0.875; 3 1.75,-0.875; 4 1.75,0.875
JSTPH3 = smd 1 x 4.6: 1 -2,-2.7; 2 0,-2.7; 3 2,-2.7 | smd 1.6 x 3.4: NC1 -4.4,2.5; NC2 4.4,2.5
1206 = smd 1.6 x 1.8: 1 -1.4,0; 2 1.4,0
SOT23-BEC = smd 1 x 1.4: B -0.95,-1.1; C 0,1.1; E 0.95,-1.1
EVQ-Q2_SMALLER = smd 2 x 1.2: A -3.1,-2; A' 3.1,-2; B -3.1,2; B' 3.1,2
SOLDERJUMPER_2WAY_OPEN_NOPASTE = smd 1.168 x 1.6: 1 -1.397,0; 2 0,0; 3 1.397,0
SOLDERJUMPER_ARROW_NOPASTE = smd 0.762 x 1.524: 1 -1.016,0; 2 1.016,0
SOLDERJUMPER_CLOSEDWIRE = smd 1.168 x 1.6: 1 -0.762,0; 2 0.762,0 | smd 0.635 x 0.203: WIRE 0,0
BUZZER_SMT_7.5MM = smd 2 x 2: + 2.8,-2.8; - 2.8,2.8; MT2 -2.8,2.8 | smd 2 x 1 rotated 135: MT -3,-3
TP15R = smd 1.5 x 1.5: TP 0,0
TESTPOINT_ROUND_1.5MM = smd 1.5 x 1.5: P$1 0,0
SOT23-5 = smd 0.55 x 1.2: 1 -0.95,-1.3; 2 0,-1.3; 3 0.95,-1.3; 4 0.95,1.3; 5 -0.95,1.3
SOIC8_208MIL = smd 0.6 x 2.2: 1 -1.905,-3.315; 2 -0.635,-3.315; 3 0.635,-3.315; 4 1.905,-3.315; 5 1.905,3.315; 6 0.635,3.315; 7 -0.635,3.315; 8 -1.905,3.315
SOIC8_150MIL = smd 0.6 x 2.2: 1 -1.905,-2.6; 2 -0.635,-2.6; 3 0.635,-2.6; 4 1.905,-2.6; 5 1.905,2.6; 6 0.635,2.6; 7 -0.635,2.6; 8 -1.905,2.6
ALS-PT26-21C = smd 1.5 x 1.6: 1_E -1.8,0; 2_C 1.8,0 | hole 2.4: 0,0
PQFN64-1 = smd 0.7 x 0.22: 1 -4.45,3.75; 2 -4.45,3.25; 3 -4.45,2.75; 4 -4.45,2.25; 5 -4.45,1.75; 6 -4.45,1.25; 7 -4.45,0.75; 8 -4.45,0.25; 9 -4.45,-0.25; 10 -4.45,-0.75; 11 -4.45,-1.25; 12 -4.45,-1.75; 13 -4.45,-2.25; 14 -4.45,-2.75; 15 -4.45,-3.25; 16 -4.45,-3.75; 33 4.45,-3.75; 34 4.45,-3.25; 35 4.45,-2.75; 36 4.45,-2.25; 37 4.45,-1.75; 38 4.45,-1.25; 39 4.45,-0.75; 40 4.45,-0.25; 41 4.45,0.25; 42 4.45,0.75; 43 4.45,1.25; 44 4.45,1.75; 45 4.45,2.25; 46 4.45,2.75; 47 4.45,3.25; 48 4.45,3.75 | smd 0.22 x 0.7: 17 -3.75,-4.45; 18 -3.25,-4.45; 19 -2.75,-4.45; 20 -2.25,-4.45; 21 -1.75,-4.45; 22 -1.25,-4.45; 23 -0.75,-4.45; 24 -0.25,-4.45; 25 0.25,-4.45; 26 0.75,-4.45; 27 1.25,-4.45; 28 1.75,-4.45; 29 2.25,-4.45; 30 2.75,-4.45; 31 3.25,-4.45; 32 3.75,-4.45; 49 3.75,4.45; 50 3.25,4.45; 51 2.75,4.45; 52 2.25,4.45; 53 1.75,4.45; 54 1.25,4.45; 55 0.75,4.45; 56 0.25,4.45; 57 -0.25,4.45; 58 -0.75,4.45; 59 -1.25,4.45; 60 -1.75,4.45; 61 -2.25,4.45; 62 -2.75,4.45; 63 -3.25,4.45; 64 -3.75,4.45 | smd 4.7 x 4.7: EXP 0,0
MOUNTINGHOLE_3.0_PLATEDTHIN = drill 3 pad 3.6: P$1 0,0
FIDUCIAL_1MM = smd 1 x 1: 1 0,0
TFT_3.2IN_240X320_50PIN = smd 0.275 x 1.2 bottom: 1 12.25,-9.39; 2 11.75,-9.39; 3 11.25,-9.39; 4 10.75,-9.39; 5 10.25,-9.39; 6 9.75,-9.39; 7 9.25,-9.39; 8 8.75,-9.39; 9 8.25,-9.39; 10 7.75,-9.39; 11 7.25,-9.39; 12 6.75,-9.39; 13 6.25,-9.39; 14 5.75,-9.39; 15 5.25,-9.39; 16 4.75,-9.39; 17 4.25,-9.39; 18 3.75,-9.39; 19 3.25,-9.39; 20 2.75,-9.39; 21 2.25,-9.39; 22 1.75,-9.39; 23 1.25,-9.39; 24 0.75,-9.39; 25 0.25,-9.39; 26 -0.25,-9.39; 27 -0.75,-9.39; 28 -1.25,-9.39; 29 -1.75,-9.39; 30 -2.25,-9.39; 31 -2.75,-9.39; 32 -3.25,-9.39; 33 -3.75,-9.39; 34 -4.25,-9.39; 35 -4.75,-9.39; 36 -5.25,-9.39; 37 -5.75,-9.39; 38 -6.25,-9.39; 39 -6.75,-9.39; 40 -7.25,-9.39; 41 -7.75,-9.39; 42 -8.25,-9.39; 43 -8.75,-9.39; 44 -9.25,-9.39; 45 -9.75,-9.39; 46 -10.25,-9.39; 47 -10.75,-9.39; 48 -11.25,-9.39; 49 -11.75,-9.39; 50 -12.25,-9.39 | smd 2.4 x 2.4 bottom: PAD1 14.35,-12.09; PAD2 -14.35,-12.09
MICROSD = smd 0.7 x 1.5: 1 9,-10.64; 2 7.9,-10.24; 3 6.8,-10.64; 4 5.7,-11.04; 5 4.6,-10.64; 6 3.5,-11.04; 7 2.4,-10.64; 8 1.3,-10.64 | smd 1.8 x 1.4: CD1 2,-0.44; CD2 8,-0.44 | smd 1.4 x 1.9: MT1 0.4,-13.54; MT2 13.6,-14.44
2X05_1.27MM_BOX_POSTS = smd 0.76 x 2.6: 1 -2.54,-2.15; 2 -2.54,2.15; 3 -1.27,-2.15; 4 -1.27,2.15; 5 0,-2.15; 6 0,2.15; 7 1.27,-2.15; 8 1.27,2.15; 9 2.54,-2.15; 10 2.54,2.15 | hole 1: -1.905,0; 1.905,0
4UCONN_20329_V2 = smd 1 x 2: BASE@1 -0.75,-2; BASE@2 0.75,-2 | smd 0.4 x 1.35: D+ 0,0.775; D- -0.65,0.775; GND 1.3,0.775; ID 0.65,0.775; VBUS -1.3,0.775 | drill 0.8 pad 1.143 offset: SPRT@1 -3.3,0.9; SPRT@2 3.3,0.9 | drill 0.9 pad 2.413 square: SPRT@3 -3.6,-1.9; SPRT@4 3.6,-1.9 | hole 0.7: -1.95,0; 1.95,0
WROOM32 = smd 1.5 x 0.9: 1 -8.6,5; 2 -8.6,3.73; 3 -8.6,2.46; 4 -8.6,1.19; 5 -8.6,-0.08; 6 -8.6,-1.35; 7 -8.6,-2.62; 8 -8.6,-3.89; 9 -8.6,-5.16; 10 -8.6,-6.43; 11 -8.6,-7.7; 12 -8.6,-8.97; 13 -8.6,-10.24; 14 -8.6,-11.51; 25 8.6,-11.51; 26 8.6,-10.24; 27 8.6,-8.97; 28 8.6,-7.7; 29 8.6,-6.43; 30 8.6,-5.16; 31 8.6,-3.89; 32 8.6,-2.62; 33 8.6,-1.35; 34 8.6,-0.08; 35 8.6,1.19; 36 8.6,2.46; 37 8.6,3.73; 38 8.6,5 | smd 0.9 x 1.5: 15 -5.7,-12.9; 16 -4.43,-12.9; 17 -3.16,-12.9; 18 -1.89,-12.9; 19 -0.62,-12.9; 20 0.65,-12.9; 21 1.92,-12.9; 22 3.19,-12.9; 23 4.46,-12.9; 24 5.73,-12.9 | smd 6 x 6: P$1 0.34,-2.7

### Placement (x,y rotation side)
C1  10.41,36.32 270 top
C2  49.53,48.64 0 top
C3  40.13,51.05 180 top
C4  12.07,36.45 270 top
C5  50.16,26.04 0 top
C6  36.2,24.26 0 top
C7  76.96,31.75 90 top
C8  14.1,36.45 270 top
C9  36.7,26.92 270 top
C10  37.97,26.92 90 top
C11  53.47,39.88 0 top
C12  31.24,39.12 0 top
C13  16.13,36.45 270 top
C14  42.93,43.43 270 top
C15  48.26,34.8 180 top
C16  39.24,26.92 90 top
C17  37.85,54.86 0 top
C18  17.14,18.16 270 top
C19  22.86,11.05 270 top
C20  30.86,7.87 270 top
CON1  27.43,14.48 0 top
D1  76.96,38.35 90 top
D2  76.71,12.83 90 top
I2C  84.45,26.54 270 top
IC1  29.46,51.69 270 top
IC2  27.56,9.65 270 top
L  9.53,12.57 90 top
LED1  34.04,55.24 90 top
NEOPIX  83.57,39.37 270 top
PTC1  8.64,17.27 270 top
Q1  54.1,18.67 270 top
R1  50.16,21.34 0 top
R2  50.16,22.86 0 top
R3  50.16,24.38 0 top
R4  49.4,45.59 0 top
R5  50.16,18.29 0 top
R6  37.85,53.34 0 top
R7  30.61,49.53 180 top
R8  8,36.07 180 top
R9  28.07,46.48 90 top
R10  13.08,12.57 180 top
R11  78.23,34.92 180 top
R12  77.85,10.03 180 top
R13  50.16,19.81 0 top
R14  49.53,47.12 0 top
R15  20.07,36.58 270 top
R16  54.48,51.69 180 top
R17  50.55,51.69 180 top
R18  17.53,28.7 270 top
R19  35.43,50.8 180 top
R20  57.78,51.69 0 top
R21  23.75,8.76 0 top
R22  20.19,8.76 0 top
RESET  43.94,55.24 180 top
SENSE  83.57,13.97 270 top
SJ1  76.71,27.43 90 top
SJ2  54.1,24.77 90 top
SJ3  55.5,46.99 180 top
SJ4  32.77,10.67 0 top
SP1  38.86,9.91 270 top
TP5  46.74,30.48 0 top
TP7  43.81,19.81 0 top
TP8  43.81,16.76 0 top
TP9  34.67,18.29 0 top
U1  12.57,17.65 270 top
U2  38.23,47.5 270 top
U3  54.36,55.12 270 top
U4  2.92,36.58 180 top
U$2  39.62,35.43 180 top
U$7  85.72,2.67 90 top
U$9  86.74,58.04 90 top
U$11  1.14,6.73 90 top
U$15  85.72,61.85 90 top
U$16  2.54,2.67 90 top
U$17  2.54,61.85 90 top
U$23  86.61,6.86 90 top
U$24  48.26,32.26 270 bottom
X1  16.38,34.29 270 top
X3  38.48,18.29 180 top
X4  4.7,14.35 270 top
X6  12.45,48.26 90 top

### Tracks (layer width: path | path; a pad name or v marks a point on that pad's centre or on a via)
3.3V  (via drill 0.48, 0.5)
  Top 0.305: U$24.42 55.75,40.51 55.5,40.26 55.5,40.13 | 55.5,40.13 55.5,40.01 | 55.5,40.01 55.5,39.62 55.61,39.51 | 55.61,39.51 54.69,39.51 C11.2 | U$24.41 v55.63,40.01 | v55.63,40.01 55.5,40.01 | 36.28,52.2 R19.1 | 34.9,53.49 33.84,54.55 32.53,54.55 32.17,54.19 32.17,52.64 | 36.28,52.32 36.27,52.32 36.27,52.12 34.9,53.49 | R6.1 36.28,52.63 36.28,52.32 | 36.28,52.32 36.28,52.2 | 39.37,29.34 U$2.56 39.37,31.88 39.5,32 42.29,32 43.47,33.18 U$2.4 45.43,33.18 46.35,32.26 46.99,32.26 v47.75,31.5 | 39.37,29.34 39.37,27.9 | X3.1 41.02,22.23 40.39,22.86 40.39,26.05 40.21,26.22 40.21,27.73 40.05,27.9 39.37,27.9 | v55.63,40.01 55.5,40.13 | v43.81,49.4 U2.8 41.08,49.86 C3.1 41.08,51.37 40.17,52.29 36.38,52.29 36.28,52.2 | U$2.48 34.48,31.68 34.04,31.24 33.75,31.24 v33.61,31.1 | 39.37,29.34 v38.65,29.34 | v33.53,39.62 33.02,39.12 C12.2 32.52,38.68 U$2.34 | SJ1.3 76.45,28.83 75.56,29.72 v75.56,30.48 | v54.1,27.56 SJ2.3 | U$24.40 55.61,39.51 | X6.2 8.72,38.29 9.02,37.99 9.02,37.07 | 9.02,37.07 10.31,37.07 C1.1 11.84,37.17 C4.1 C8.1 C13.1 16.7,37.4 20.45,33.66 20.45,30.65 | 9.02,37.07 7.12,37.07 5.84,38.35 1.78,38.35 1.12,37.7 U4.2_C 1.12,29.74 2.27,28.59 | 2.27,28.59 X1.4 | 13.97,18.6 v15.49,18.6 16.96,18.6 17.14,18.78 C18.1 | 13.97,18.6 U1.5 | 2.27,28.59 2.27,25.67 5.33,22.61 11.68,22.61 13.97,20.32 13.97,18.6 | 20.45,30.65 20.9,31.1 v27.18,31.1 | C15.2 47.02,35.18 U$2.8 43.18,35.18 42.93,35.44 42.93,37.84 41.37,39.4 U$2.21 41.37,42.39 v41.66,42.67 41.74,42.58 C14.2 | C16.2 39.37,27.9 | v58.93,57.28 58.84,57.18 57.15,57.18 | 57.15,57.18 57.12,57.18 U3.8 55.88,57.02 55.37,56.52 55.37,51.73 R16.1 55.37,51.69
  Top 0.305: 57.15,57.18 57.15,57.09 57.97,57.09 v66.04,49.02 | LED1.2 34.9,53.49 | R20.1 55.37,51.69 | R17.1 52.28,50.81 54.49,50.81 55.37,51.69 | R22.1 v17.53,8.76 | 20.45,30.65 19.35,29.55 R18.1 | R9.2 28.07,47.88 28.83,48.64 32.13,48.64 32.89,49.4 32.89,51.82 32.17,52.54 32.17,52.64 | 32.17,52.64 IC1.5
  Bottom 0.305: v38.65,29.34 35.37,29.34 v33.61,31.1 33.59,31.12 27.19,31.12 v27.18,31.1 26.42,31.86 26.42,37.93 27.81,39.32 32.27,39.32 32.57,39.62 v33.53,39.62 33.53,40.77 35.43,42.67 v41.66,42.67 41.66,40 42.67,38.99 44.96,38.99 47.24,41.27 47.24,45.97 v43.81,49.4 | v75.56,30.48 75.06,30.99 75.06,46.48 72.52,49.02 v66.04,49.02 64.14,49.02 63.37,48.26 63.37,41.78 61.59,40.01 v55.63,40.01 56.13,39.5 56.13,29.59 v54.1,27.56 53.34,26.8 52.45,26.8 v47.75,31.5 | v15.49,18.6 15.37,18.48 15.37,17.53 14.35,16.51 14.35,12.19 17.53,9.02 v17.53,8.76 | v53.85,57.19 58.84,57.19 v58.93,57.28
!RESET
  Top 0.254: 46.86,53.24 RESET.B' 38.79,53.24 R6.2 38.7,53.72 38.76,53.79 | 46.86,53.24 RESET.B | U$2.52 37.37,30.01 34.29,26.92 34.29,18.67 TP9.P$1 | 35.55,16.14 X3.10 35.94,14.99 39.75,11.18 45.21,11.18 48.51,14.48 61.85,14.48 63.5,16.13 63.5,48.77 62.36,49.91 54.48,49.91 54.07,50.32 49.5,50.32 46.86,52.96 46.86,53.24
  Top 0.305: 35.55,16.14 34.67,17.02 TP9.P$1 | 38.76,53.79 38.7,53.85 C17.2
+5V  (via drill 0.48)
  Top 0.305: R4.1 48.68,45.72 R14.1 48.68,48.54 C2.1 48.58,49.22 49.15,49.78 53.85,49.78 54.23,49.4 61.98,49.4 62.99,48.39 62.99,16.89 62.1,16 55.63,16 v55.56,16.07 | v46.99,24.26 47.12,24.38 R3.1 R2.1 R1.1 R13.1 | SJ1.1 76.71,24.13 v76.83,24 | PTC1.1 10.16,18.67 | 10.16,18.67 11.2,18.67 U1.1 11.18,18.7 v11.18,19.56 | U1.3 10.6,16.7 10.16,17.14 10.16,18.67 | IC2.5 30.03,9.65 C20.1 32.45,8.82 v32.77,8.51
  Top 0.406: C5.1 49.21,24.48 R3.1
  Bottom 0.305: 32.77,21.72 37.46,21.72 40.13,24.38 46.86,24.38 v46.99,24.26 55.18,16.07 v55.56,16.07 57.15,14.48 74.55,14.48 76.83,16.76 v76.83,24 | 32.77,21.72 13.34,21.72 v11.18,19.56 | v32.77,8.51 32.77,21.72
AUDIO_OUT  (via drill 0.48)
  Top 0.254: U$2.3 45.25,32.68 46.61,31.32 46.61,30.61 TP5.TP | v29.84,24.64 28.59,24.64 22.42,18.47 22.42,12.34 C19.1
  Top 0.305: TP5.TP v46.48,30.23
  Bottom 0.254: v46.48,30.23 46.35,30.1 44.2,30.1 43.69,29.59 43.69,26.54 42.56,25.41 38.8,25.41 38.02,24.64 v29.84,24.64
CARDDET  (via drill 0.48)
  Top 0.254: U$2.2 44.91,32.18 45.27,31.82 v45.27,31.04
  Top 0.305: v18.41,26.54 18.16,26.29 X1.CD2
  Bottom 0.254: v45.27,31.04 45.09,30.86 44.2,30.86 41.15,27.81 19.69,27.81 v18.41,26.54
D3
  Top 0.254: R12.1 78.93,10.03 SENSE.3
D3_UNSAFE  (via drill 0.48)
  Top 0.203: U$2.13 44.16,37.77 45.18,37.77 46.75,39.34 47.72,39.34 48.16,39.79 v48.5,39.79 | v65.15,52.07 66.45,50.77 70.48,50.77 74.78,46.48 74.78,13.49 D2.C
  Top 0.254: D2.C 76.71,10.33 R12.2
  Bottom 0.203: v48.5,39.79 48.16,40.13 48.16,40.4 48.11,40.45 48.11,43.77 48.76,44.43 53.76,44.43 55.91,46.57 55.91,49.87 58.97,52.93 63.91,52.93 65.02,51.82 65.02,51.94 v65.15,52.07
D4
  Top 0.254: NEOPIX.3 80.87,36.71 R11.1
D4_UNSAFE  (via drill 0.48)
  Top 0.203: U$2.14 44.14,38.25 45.09,38.25 46.93,40.09 v47.41,40.09 | v65.15,53.21 67.18,51.18 70.87,51.18 75.18,46.86 75.18,38.86 D1.C
  Top 0.254: R11.2 76.96,35.34 D1.C
  Bottom 0.203: v47.41,40.09 47.41,40.8 47.7,41.09 47.7,43.94 48.59,44.83 53.59,44.83 55.5,46.74 55.5,50.04 58.8,53.34 65.02,53.34 v65.15,53.21
D13
  Top 0.203: R10.1 19.69,12.57 21.58,14.47 21.58,20.38 28.15,26.95 32.91,26.95 36.37,30.41 U$2.50
D+
  Top 0.254: U$2.46 32.96,32.68 29.89,29.62 25.53,29.62 19.41,23.5 19.41,16.45 16.98,14.02 7.56,14.02 7.23,14.35 6.6,14.35 6.49,14.35 X4.D+
D-
  Top 0.254: 32.81,33.18 U$2.45 | 32.72,33.18 29.64,30.1 25.15,30.1 18.92,23.88 18.92,16.78 16.62,14.48 7.75,14.48 7.22,15 X4.D-
  Top 0.305: 32.72,33.18 32.81,33.18
ESP_BUSY
  Top 0.254: X6.9 17.61,39.02 18.24,38.39 21.81,38.39 23.08,37.12 25.12,37.12 27.11,35.13 29.53,35.13 30.54,36.14 30.99,36.14 31.03,36.18 U$2.39
ESP_CS
  Top 0.254: X6.29 18.88,57.99 19.3,58.42 24.64,58.42 27.18,55.88 27.18,52.64 | U$2.27 38.37,42.27 36.6,44.04 33.15,44.04 32.04,45.16 28.54,45.16 R9.1 27.56,45.63 27.18,46.01 27.18,52.64 | IC1.1 27.18,52.64
ESP_GPIO0
  Top 0.254: U$2.28 37.87,42.02 36.38,43.51 32.93,43.51 31.87,44.57 27.56,44.57 26.67,45.47 26.67,54.61 24.42,56.86 X6.25
ESP_MISO  (via drill 0.48)
  Top 0.254: IC1.2 28.96,51.69 29.21,51.44 | 29.21,51.44 29.21,50.08 R7.2 | X6.37 8.72,58.12 v9.02,58.42 | v28.07,53.59 28.96,53.59 29.34,53.21 29.34,51.56 29.21,51.44
  Bottom 0.254: v9.02,58.42 10.97,56.46 24.56,56.46 27.43,53.59 v28.07,53.59
ESP_RESET
  Top 0.254: X6.3 9.99,38.48 17.14,38.48 17.91,37.72 20.07,37.72 R15.1 20.83,36.66 24.93,36.66 26.92,34.67 29.72,34.67 30.73,35.68 U$2.40
ESP_RTS  (via drill 0.48, 0.5)
  Top 0.254: X6.31 16.34,57.58 v15.49,58.42 | U$2.32 35.87,40.71 35.18,41.4 32.13,41.4 31.74,41.02 29.47,41.02 28.32,42.16 v28.32,42.42
  Bottom 0.254: v15.49,58.42 16.08,57.84 26.35,57.84 30.28,53.91 30.28,46.41 28.32,44.45 v28.32,42.42
GND  (via drill 0.48)
  Top 0.203: X3.9 X3.7 X3.5
  Top 0.254: U$2.54 38.37,34.18 U$2.EXP | U$2.7 40.37,34.68 U$2.EXP | U$2.22 40.87,36.68 U$2.EXP | U$2.33 35.87,39.18 U$2.EXP | C2.2 51.05,48.64 51.94,47.75 51.94,46.61 53.72,44.83 v56.01,44.83
  other vias: 43.94,57.28 37.72,50.42 38.23,37.08 39.75,37.08 41.4,37.08 34.67,40.26 18.03,42.04 27.43,36.45 46.99,22.35 39.12,24.64 36.7,22.73 39.62,22.48 59.31,22.61 59.05,41.02 59.44,43.05 40.77,44.2 36.96,45.85 31.37,55.24 6.86,52.96 68.33,52.07 75.95,49.4 85.72,30.23 80.64,30.99 6.73,58.29 13.08,51.18 17.65,51.18 17.65,46.61 12.95,46.48 20.07,54.48 23.11,54.36 8.25,33.78 7.62,38.23 23.24,34.54 31.24,13.21 20.57,6.1 26.92,15.49 23.49,24.51 19.18,14.48 6.99,12.95 15.88,15.75 26.8,43.69 53.59,53.72 48.13,50.42 33.78,55.63 32.64,5.97 29.21,6.1 28.07,49.53 6.99,50.55 6.86,47.62 6.73,44.58 6.6,41.66 6.73,54.99 10.54,54.61 9.27,49.28 9.53,45.47 9.65,42.16 12.19,43.94 15.11,41.53 15.37,44.45 19.94,44.58 23.11,42.55 22.73,45.47 22.86,48.9 20.32,47.37 19.69,50.8 22.61,51.05 16.89,52.96 15.37,54.86 12.95,53.09 9.53,52.07
  pour Top: 6.35,59.18 88.27,59.18 88.27,5.21 -0.13,5.21 -0.13,38.99 6.35,38.99
  pour Bottom: 6.35,59.18 88.27,59.18 88.27,5.21 -0.13,5.21 -0.13,38.99 6.35,38.99
LCD_DATA0  (via drill 0.5)
  Top 0.254: v29.08,38.48 29.38,38.18 U$2.35 | v54.36,36.2 54.36,36.07 54.92,35.51 U$24.32
  Bottom 0.254: v29.08,38.48 32.89,38.48 35.31,36.07 52.45,36.07 52.58,36.2 v54.36,36.2
LCD_DATA1  (via drill 0.5)
  Top 0.254: U$24.31 53.97,35.01 v53.57,35.41 | v28.32,37.62 28.32,37.68 U$2.36
  Bottom 0.254: v53.57,35.41 53.46,35.41 53.26,35.61 34.87,35.61 32.86,37.62 v28.32,37.62
LCD_DATA2  (via drill 0.5)
  Top 0.254: v29.49,36.84 29.83,37.18 U$2.37 | U$24.30 53.03,34.51 52.71,34.82 v52.59,34.82
  Bottom 0.254: v29.49,36.84 33,36.84 34.69,35.15 49.66,35.15 49.98,34.82 v52.59,34.82
LCD_DATA3  (via drill 0.5)
  Top 0.254: U$2.38 30.44,36.68 29.81,36.06 28.82,36.06 v28.76,36 | v52.03,33.72 52.32,34.01 U$24.29
  Bottom 0.254: v28.76,36 28.82,36.06 29.81,36.06 30.14,36.38 32.81,36.38 34.49,34.7 49.32,34.7 49.86,34.16 51.43,34.16 51.88,33.72 v52.03,33.72
LCD_DATA4  (via drill 0.5)
  Top 0.254: U$24.28 52.93,33.51 52.36,32.93 51.69,32.93 51.63,32.99 51.32,32.99 v50.94,33.37 | U$2.41 31.46,35.18 v31.12,34.84
  Bottom 0.254: v50.94,33.37 49.94,33.37 49.07,34.24 34.31,34.24 33.71,34.84 v31.12,34.84
LCD_DATA5  (via drill 0.5)
  Top 0.254: U$2.42 32.07,34.68 31.31,33.93 28.81,33.93 v28.68,33.8 | v51.31,32.2 52.27,32.2 53.08,33.01 U$24.27
  Bottom 0.254: v28.68,33.8 28.81,33.93 31.69,33.93 32.02,34.25 33.64,34.25 34.12,33.78 48.77,33.78 50.35,32.2 v51.31,32.2
LCD_DATA6  (via drill 0.5)
  Top 0.254: U$24.26 53.23,32.51 52.46,31.75 52.45,31.75 52.07,31.37 50.45,31.37 v50.39,31.42 | U$2.43 32.21,34.18 31.5,33.47 30.17,33.47 v29.84,33.15
  Bottom 0.254: v50.39,31.42 50.36,31.42 48.45,33.32 33.93,33.32 33.5,33.75 32.16,33.75 31.88,33.47 30.17,33.47 v29.84,33.15
LCD_DATA7  (via drill 0.5)
  Top 0.254: U$2.44 32.46,33.68 31.32,32.54 v30.94,32.54 | v52.07,30.59 52.18,30.59 53.6,32.01 U$24.25
  Bottom 0.254: v30.94,32.54 31.26,32.87 48.26,32.87 49.61,31.52 49.61,30.91 49.93,30.59 v52.07,30.59
LEDK
  Top 0.254: U$24.1 55.2,20.01 Q1.C
LIGHT  (via drill 0.48)
  Top 0.254: U$2.16 44.76,39.18 46.74,41.16 46.74,45.09 v46.35,45.47
  Top 0.305: R8.2 5.23,36.07 U4.1_E 4.72,35.54 v5.21,35.05
  Bottom 0.254: v46.35,45.47 42.98,48.84 37.86,48.84 37.28,49.42 33.55,49.42 32.38,48.26 32.38,40.77 31.88,40.26 25.27,40.26 24.28,39.27 23.24,39.27 12.92,28.94 10.22,28.94 10.21,28.96 7.49,28.96 5.21,31.24 v5.21,35.05
MISO  (via drill 0.48)
  Top 0.254: U$2.31 36.37,41.22 35.56,42.04 32.4,42.04 32.39,42.04 30.99,42.04 30.87,41.92 v30.87,41.79 | U$24.33 58.39,36.01 58.42,35.98 60.63,35.98 62.48,37.83 62.48,48.01 61.59,48.9 53.85,48.9 53.47,49.28 52.45,49.28 v52.07,48.9 | X1.7 10.17,31.89 10.29,32 10.41,32 v10.54,32.13 | v32.02,51.05 31.7,50.74 31.46,50.74 31.46,50.67 | 31.46,50.67 R7.1 | IC1.4 31.39,50.74 31.46,50.67
  Bottom 0.254: v52.07,48.9 52.07,49.86 50.19,51.74 33.58,51.74 32.89,51.05 v32.02,51.05 31.94,50.98 31.94,50.1 31.75,49.91 31.75,44.2 30.74,43.19 30.74,41.92 v30.87,41.79 30.35,41.27 19.69,41.27 v10.54,32.13
MOSI  (via drill 0.48)
  Top 0.254: U$2.29 37.37,41.75 36.07,43.05 32.74,43.05 31.82,43.97 29.91,43.97 v29.73,43.8 28.18,43.8 27.18,42.8 27.18,40.27 25.01,38.1 v23.37,38.1 22.69,38.78 X6.13 | U$24.34 57.65,36.54 60.42,36.54 61.98,38.1 61.98,47.75 61.34,48.39 53.25,48.39 v53.21,48.35 | X1.3 5.9,27.65 13.8,27.65 17.91,31.75 v18.54,31.75
  Bottom 0.254: v53.21,48.35 53.21,49.49 50.51,52.2 32.02,52.2 31.24,51.42 31.24,45.21 29.83,43.8 v29.73,43.8 | v23.37,38.1 23.37,36.58 v18.54,31.75
N$1
  Top 0.254: U$24.48 53.61,43.51 51.52,45.59 R4.2
N$2
  Top 0.254: U$24.3 53.02,21.01 52.69,21.34 R1.2 | R1.2
N$3
  Top 0.254: U$24.4 53.17,21.51 51.82,22.86 | 51.82,22.86 | 51.82,22.86 R2.2
N$4
  Top 0.254: U$24.5 53.43,22.01 51.05,24.38 R3.2
N$5
  Top 0.254: U$24.9 56.52,24.01 56.39,23.88 56.39,23.5 | U$24.7 56.49,23.01 56.39,23.11 56.39,23.5 | U$24.8 56.4,23.51 56.39,23.5 | 56.39,23.5 56.01,23.5 54.74,24.77 SJ2.2
N$6
  Top 0.254: R14.2 50.65,47.12 53.75,44.01 U$24.49
N$7
  Top 0.254: U$24.2 51.71,20.51 R13.2
N$8
  Top 0.254: R10.2 L.A
N$9
  Top 0.305: 54.1,24.89 54.1,23.37
N$10
  Top 0.305: R21.1 22.86,8.8 C19.2
N$11
  Top 0.305: IC2.3 24.66,8.7 R21.2
N$13
  Top 0.305: SJ4.2 38.1,10.67 SP1.-
N$16
  Top 0.254: Q1.B 51.67,18.29 R5.2
NEOPIX  (via drill 0.48)
  Top 0.254: U$2.49 35.11,30.98 33.34,29.21 v32.01,29.21 v32,29.21 | LED1.1 33.41,53.24 33.41,47.62 v33.16,47.37
  Bottom 0.254: v32,29.21 27.3,29.21 25.4,31.12 25.4,37.59 27.61,39.8 32.07,39.8 32.84,40.58 32.84,47.05 v33.16,47.37
QSPI_CS
  Top 0.254: U$2.24 39.87,43.18 37.97,45.09 37.97,48.64 37.21,49.4 U2.1 34.58,49.73 R19.2
QSPI_DATA[0]  (via drill 0.5)
  Top 0.254: U2.5 v39.75,45.59 | v45.78,41.34 45.78,41.27 44.39,39.88 U$2.17
  Bottom 0.254: v39.75,45.59 41.15,45.59 45.4,41.34 v45.78,41.34
QSPI_DATA[1]  (via drill 0.5)
  Top 0.254: v44.73,45.47 45.51,44.68 45.51,42.21 44.07,40.77 43.18,40.77 42.87,40.46 U$2.18 | v36.83,48.26 36.7,48.13 U2.2
  Bottom 0.254: v44.73,45.47 44.6,45.47 41.68,48.39 36.96,48.39 v36.83,48.26
QSPI_DATA[2]  (via drill 0.5)
  Top 0.254: U2.3 36.83,46.86 v36.96,46.99 | U$2.19 42.37,40.58 42.42,40.63 42.42,40.65 42.99,41.22 43.81,41.22 44.73,42.13 v44.73,44.07
  Bottom 0.254: v36.96,46.99 37.46,47.5 41.55,47.5 44.73,44.32 v44.73,44.07
QSPI_DATA[3]
  Top 0.254: U$2.20 41.87,40.73 41.96,40.82 41.96,40.84 42.8,41.68 43.59,41.68 43.94,42.04 43.94,46.86 42.67,48.13 U2.7
QSPI_SCK
  Top 0.254: U$2.23 40.37,43.33 38.48,45.22 38.48,45.85 39.5,46.86 U2.6
RXD  (via drill 0.48)
  Top 0.254: U$2.26 38.87,42.47 36.84,44.5 33.34,44.5 32.12,45.72 30.1,45.72 v29.21,46.61
  Top 0.305: X6.35 11.26,58.12 v11.56,58.42
  Bottom 0.254: v11.56,58.42 13.06,56.92 25.92,56.92 29.08,53.76 29.08,48.77 28.45,48.13 28.45,47.37 v29.21,46.61
SCK  (via drill 0.48)
  Top 0.254: U$2.30 36.87,41.5 35.78,42.6 31.7,42.6 | X6.30 17.61,58.44 v17.78,58.61 | 31.7,42.6 31.61,42.69 v31.61,42.94 | v29.84,42.7 29.95,42.6 31.7,42.6 | v52.96,46.86 54.36,46.86 SJ3.2
  Top 0.305: v10.54,29.72 5.77,29.72 X1.5
  Bottom 0.254: 24,39.75 25.02,40.77 31.5,40.77 31.75,41.02 31.75,42.5 31.61,42.64 v31.61,42.94 | v17.78,58.61 26.23,58.61 30.8,54.04 30.8,51.88 | v52.96,46.86 53.34,46.86 54.1,47.62 54.1,49.25 50.65,52.7 31.62,52.7 30.8,51.88 | v29.84,42.7 29.73,42.7 28.78,43.65 28.78,44.13 30.78,46.14 30.78,51.87 30.8,51.88
  Bottom 0.305: 24,39.75 22.86,39.75 12.83,29.72 v10.54,29.72
SCL  (via drill 0.48)
  Top 0.254: U$2.64 43.37,30.59 44.22,29.75 | v84.07,23.62 84,23.54 I2C.4 | 44.22,29.75 | 44.22,29.75 v44.86,29.11 | v44.86,29.11 | R16.2 53.63,51.98 54.61,52.96 54.61,54.36 v53.59,55.37 53.59,56.01 52.58,57.02 U3.1
  Bottom 0.254: v84.07,23.62 84.96,24.51 84.96,26.04 84.58,26.42 78.74,26.42 | 78.74,26.42 75.69,26.42 74.42,25.15 74.42,17.4 73.2,16.18 58.05,16.18 46.34,27.89 46.34,28.38 45.9,28.82 45.15,28.82 v44.86,29.11 | v53.59,55.37 53.9,55.07 67.29,55.07 75.62,46.74 75.62,33.73 78.74,30.61 78.74,26.42
SD_CS  (via drill 0.48, 0.5)
  Top 0.254: U$2.59 40.87,29.23 42.04,28.07 v42.04,26.92 | 9.78,26.39 13.31,26.39 15.24,28.32 17.06,28.32 R18.2 19.27,27.85 v20.19,26.92
  Top 0.305: 9.78,26.39 X1.2
  Bottom 0.254: v42.04,26.92 41.02,26.92 40.64,27.3 21.59,27.3 21.21,26.92 v20.19,26.92
SDA  (via drill 0.48)
  Top 0.254: U$2.63 42.87,29.9 44.83,27.94 v45.47,27.94 | v84.07,25.53 80.77,25.53 I2C.3 | U3.2 v49.53,55.75 49.53,51.86 R17.2
  Bottom 0.254: 83.06,25.53 76.58,25.53 75.82,24.77 75.82,17.02 74.45,15.65 57.76,15.65 v45.47,27.94 | 83.06,25.53 v84.07,25.53 | v45.47,27.94 | v49.53,55.75 50.16,56.39 66.72,56.39 76.07,47.04 76.07,34.16 82.68,27.56 84.71,27.56 85.47,26.8 85.47,23.75 84.57,22.85 83.75,22.85 83.74,22.86 83.57,22.86 83.06,23.37 83.06,25.53
SPK_SD
  Top 0.203: U$2.51 36.87,30.34 33.08,26.54 28.32,26.54 21.99,20.21 21.99,9.71 R22.2 23.33,6.48 27.52,6.48 28.86,7.82
  Top 0.305: 28.86,7.82 IC2.4
SPKR+  (via drill 0.48)
  Top 0.305: CON1.2 v26.81,11.68 26.81,11.15 IC2.1 | SP1.+ 33.15,7.11 v33.27,7.11
  Bottom 0.305: v33.27,7.11 30.86,7.11 26.8,11.18 26.81,11.19 v26.81,11.68
SPRK-
  Top 0.305: CON1.1 28.06,11.4 IC2.6 31.94,10.6 SJ4.1
SWCLK  (via drill 0.5)
  Top 0.254: U$2.57 39.87,28.81 40.8,27.89 40.8,26.41 41.71,25.5 41.71,23.67 41.53,23.5 41.4,23.5 v41.27,23.37 | X3.4 39.75,15 40.39,14.36 41.66,14.36 v42.42,15.11 43.81,16.51 TP8.P$1
  Bottom 0.254: v41.27,23.37 41.27,16.26 v42.42,15.11
SWDIO
  Top 0.254: X3.2 41.92,16.14 42.16,16.38 42.16,19.81 | 42.16,19.81 42.16,25.69 41.25,26.6 41.25,28.2 40.37,29.08 U$2.58 | TP7.P$1 42.16,19.81
TFT_BACKLITE
  Top 0.254: R5.1 46.01,21.59 44.07,21.59 42.62,23.04 42.62,26.4 42.82,26.6 42.82,27.25 42.49,27.57 42.49,28.26 41.37,29.38 U$2.60
TFT_CS  (via drill 0.48)
  Top 0.254: U$2.9 47.77,35.68 49.24,37.15 49.24,37.85 49.51,38.12 49.9,38.51 U$24.38 59.97,38.51 60.45,38.99 v60.45,40.89 | v60.2,51.69 R20.2
  Top 0.305: v49.91,37.72 49.51,38.12
  Bottom 0.254: v60.2,51.69 60.2,45.72 60.58,45.34 60.58,40.89
  Bottom 0.305: 60.58,40.89 v60.45,40.89
TFT_RD
  Top 0.254: U$24.35 53.47,37.01 49.47,33 46.36,33 45.68,33.68 U$2.5
TFT_RESET
  Top 0.254: U$2.1 44.07,31.05 45.78,29.34 55.37,29.34 56.39,28.32 56.39,24.94 56.82,24.51 U$24.10
TFT_RS
  Top 0.254: U$2.6 | U$2.6 44.84,34.18 45.83,34.18 46.55,33.46 49.28,33.46 50.71,34.89 50.71,37.4 51.32,38.01 U$24.37 60.74,38.01 61.47,38.73 61.47,42.55 57.02,46.99 SJ3.1
TFT_TE
  Top 0.254: U$2.10 47.63,36.18 48.78,37.34 48.78,38.24 49.55,39.01 U$24.39
TFT_WR  (via drill 0.5)
  Top 0.254: U$24.36 52.49,37.51 51.94,36.96 v51.56,36.96 | v47.24,37.85 46.58,37.18 U$2.12
  Bottom 0.254: v51.56,36.96 51.43,36.83 47.75,36.83 47.24,37.34 v47.24,37.85
TOUCH_XL  (via drill 0.48)
  Top 0.203: U$2.62 42.37,29.56 43.33,28.6 43.33,27.98 44.87,26.44 46.06,26.44 48.07,28.45 51.82,28.45 v51.87,28.51 | v48.88,40.89 48.88,42.01 49.22,42.35
  Top 0.254: U$24.46 49.38,42.51 49.22,42.35
  Bottom 0.203: v51.87,28.51 51.94,28.57 53.16,28.57 55.22,30.64 55.22,37.8 52.1,40.92 50.7,40.92 50.16,40.39 49.38,40.39 v48.88,40.89
TOUCH_XR
  Top 0.254: U$2.11 47.48,36.68 48.32,37.53 48.32,38.51 51.05,41.23 53.27,41.23 53.55,41.51 U$24.44
TOUCH_YD  (via drill 0.48)
  Top 0.203: U$2.61 41.87,29.49 42.93,28.44 42.93,27.81 44.7,26.04 46.35,26.04 48.01,27.69 52.84,27.69 v52.96,27.8 | v49.91,41.4 50.2,41.69 52.96,41.69
  Top 0.254: U$24.45 53.28,42.01 52.96,41.69
  Bottom 0.203: v52.96,27.8 55.63,30.47 55.63,37.97 52.2,41.4 v49.91,41.4
TOUCH_YU
  Top 0.254: U$2.15 44.91,38.68 49.23,43.01 U$24.47
TXD  (via drill 0.48)
  Top 0.254: U$2.25 39.37,42.8 37.21,44.96 33.53,44.96 32.26,46.23 30.86,46.23 v29.34,47.75
  Top 0.305: X6.34 12.53,58.12 v12.83,58.42
  Bottom 0.254: v12.83,58.42 12.83,58.34 13.79,57.38 26.11,57.38 29.59,53.9 29.59,48.01 v29.34,47.75
VBUS
  Top 0.305: X4.VBUS 8.41,15.65 PTC1.2
VCC
  Top 0.254: 77.85,27.56 80.39,27.56 80.74,27.56 I2C.2 | 77.85,27.56 76.77,27.56 76.71,27.5 SJ1.2 76.71,26.16 | SENSE.2 78.23,13.97 77.85,14.35 77.85,27.56 | C7.1 77.98,29.78 77.98,27.69 77.85,27.56
  Top 0.305: NEOPIX.2 83.31,39.37 83.82,38.86 83.82,36.32 83.19,35.69 83.19,31.62 84.07,30.73 84.07,28.45 83.19,27.56 80.39,27.56
VDDCORE
  Top 0.254: C6.1 35.24,26.99 36.03,27.77 C9.1 C10.2 37.87,27.87 U$2.53